# Altium project IMX8SoCIot.PrjPcb (part 5 of 9)

## Sheet IMX8_PHY.SchDoc
size 594 x 420 mm; SheetNumber: 9; SheetTotal: 20
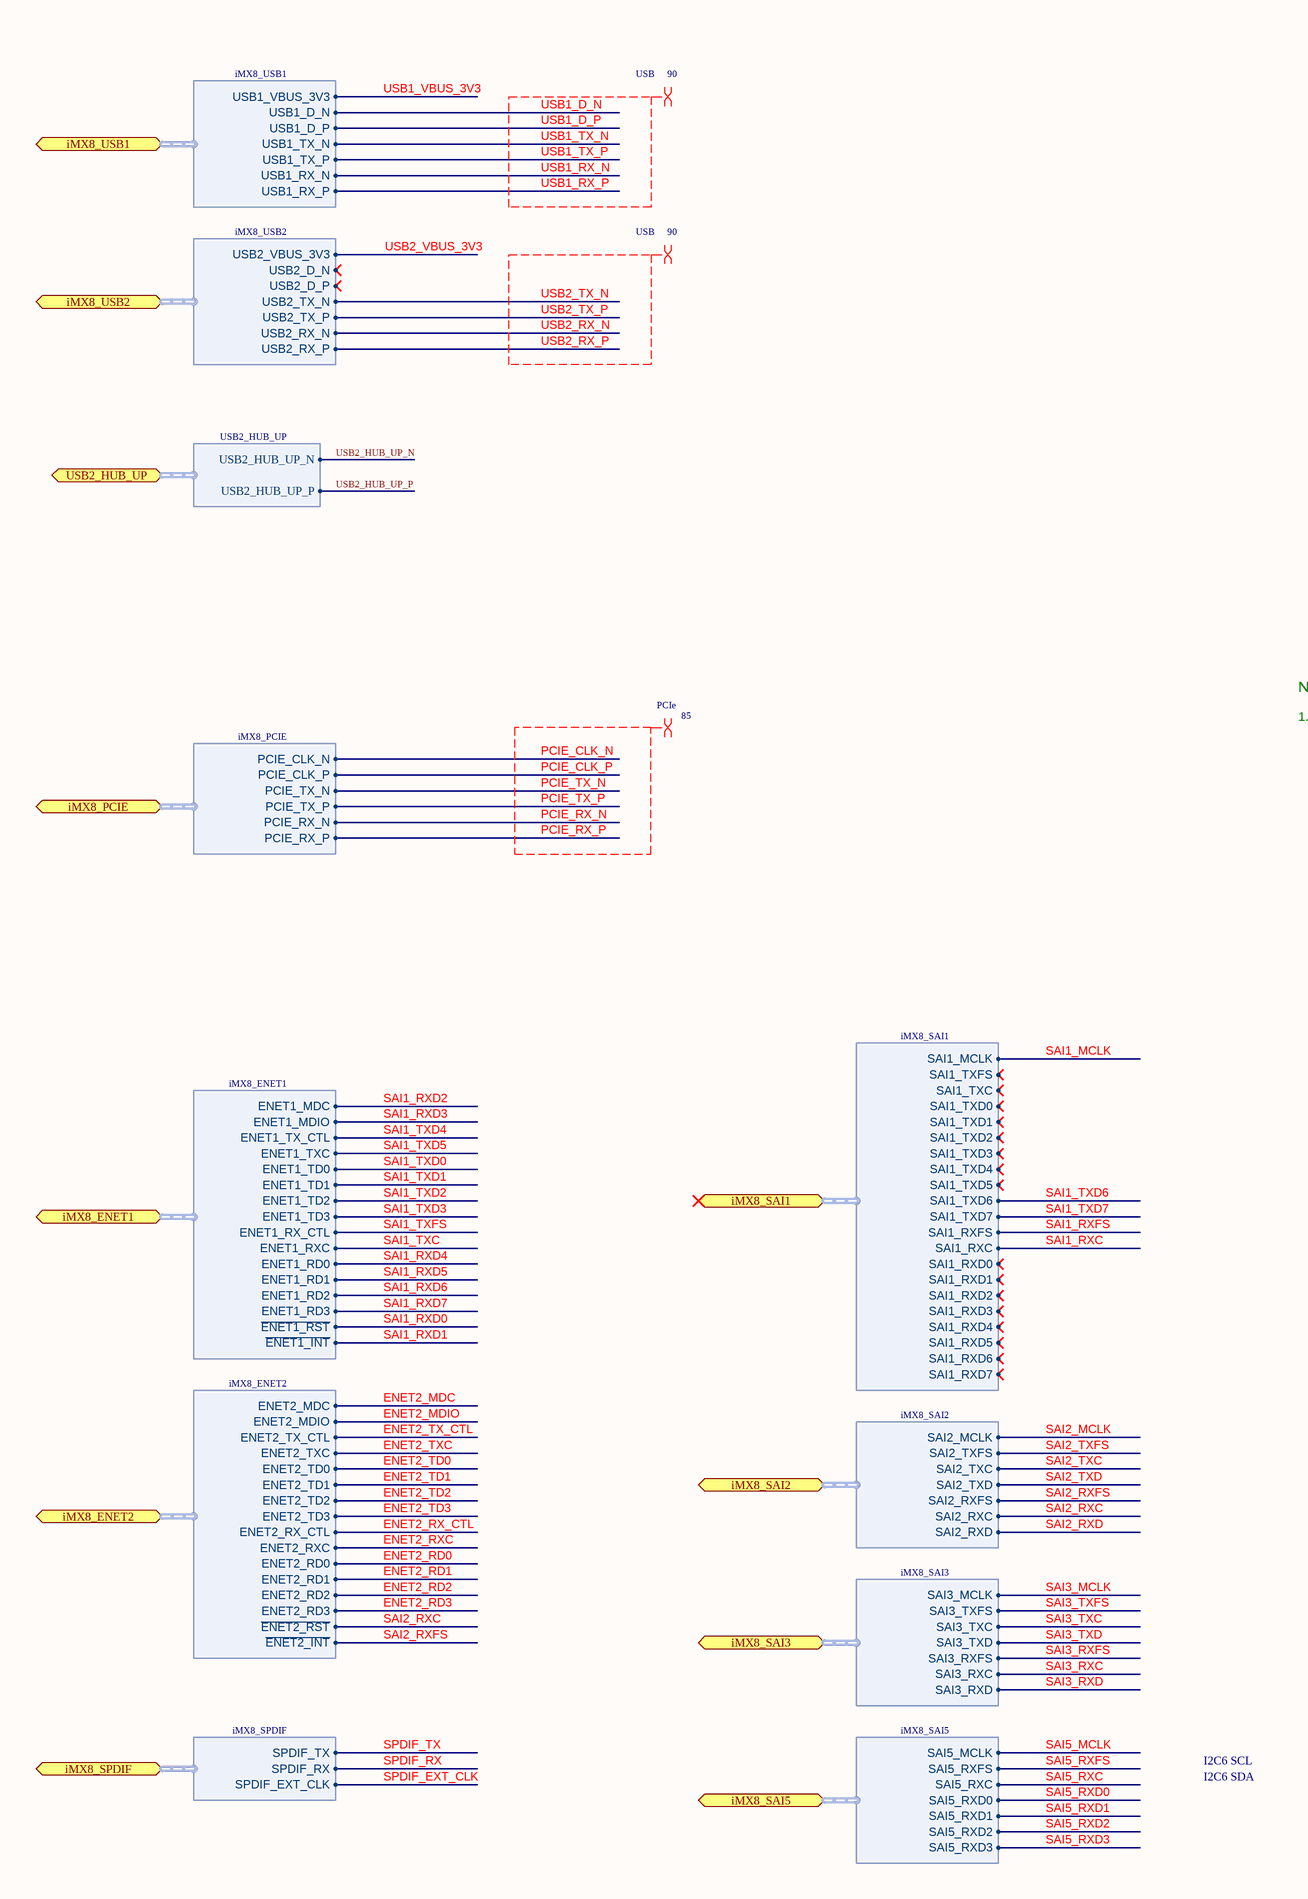
[diagram p18: IMX8_PHY.SchDoc, left]
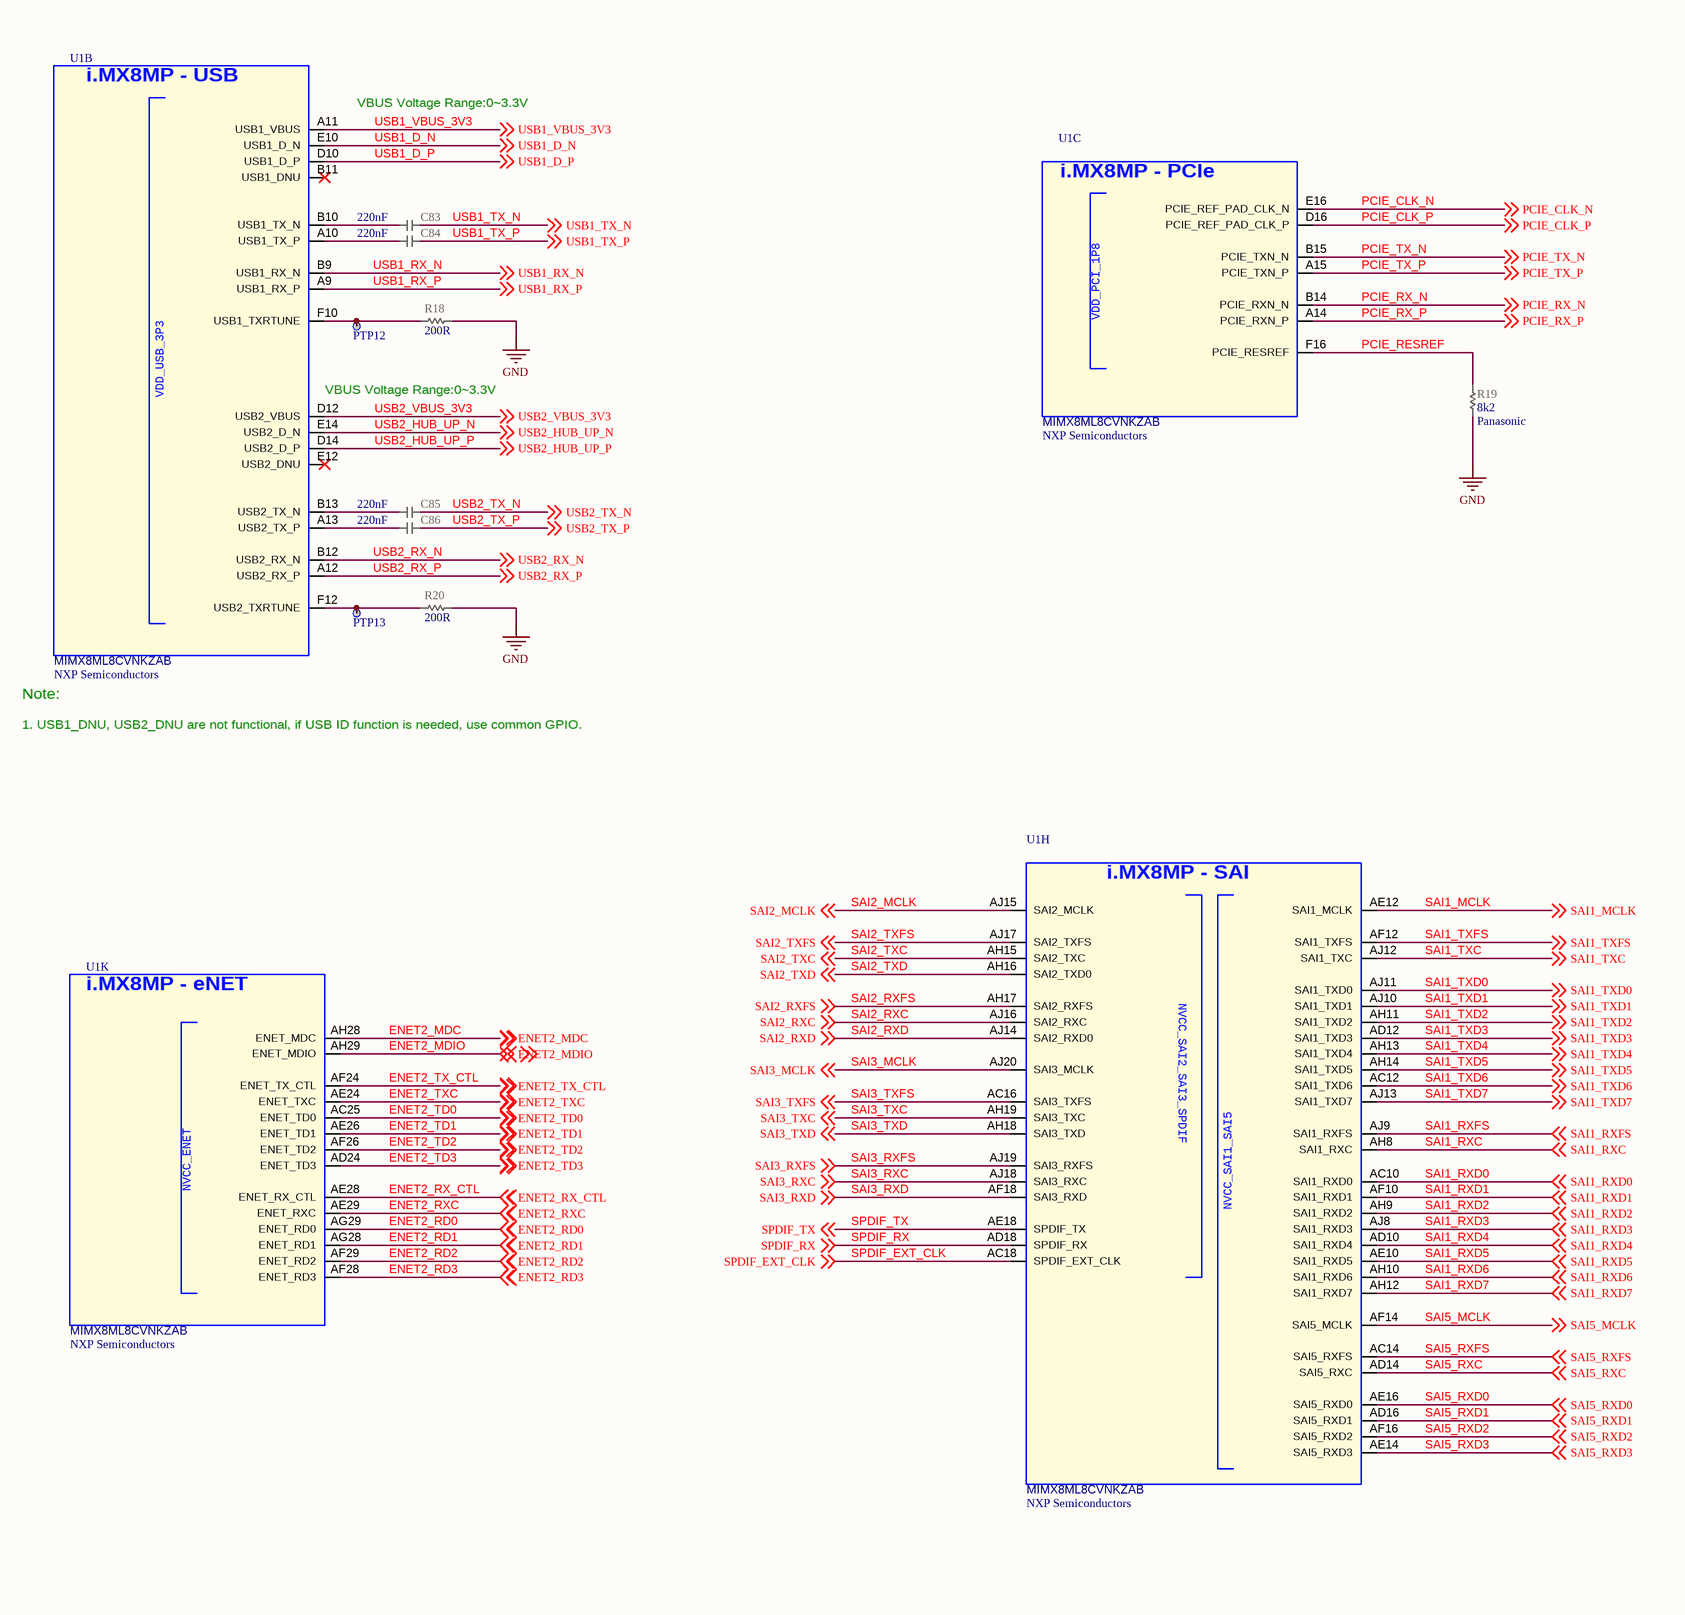
[diagram p19: IMX8_PHY.SchDoc, right]

### Parts
(Parts that share a designator on the sheet are numbered #1, #2 ... from top to bottom, then left to right.)
C83  value 220nF  [CAP_0201_UN1Q]  (hidden comment: CAP_0201_220n_10V_X6S)
C84  value 220nF  [CAP_0201_UN1Q]  (hidden comment: CAP_0201_220n_10V_X6S)
C85  value 220nF  [CAP_0201_UN1Q]  (hidden comment: CAP_0201_220n_10V_X6S)
C86  value 220nF  [CAP_0201_UN1Q]  (hidden comment: CAP_0201_220n_10V_X6S)
PTP12  PTP_0.4mm  [PTP_0.4mm]  (value not drawn)  (no BOM)
PTP13  PTP_0.4mm  [PTP_0.4mm]  (value not drawn)  (no BOM)
R18#2  value 200R  [RES_0201_UN1Q]  (hidden comment: RES_0201_200R)
R19#2  value 8k2  Manufacturer: Panasonic  [RES_0201_UN1Q]  (hidden comment: RES_0201_8k2)
R20  value 200R  [RES_0201_UN1Q]  (hidden comment: RES_0201_200R)
U1  Manufacturer: NXP Semiconductors  [BGA548C50P29X29_1500X1500X148]  (hidden comment: MIMX8ML8CVNKZAB)  (parts B,C,H,K of 15)

### Ports
iMX8_ENET1 (bidir, harness iMX8_ENET1), iMX8_ENET2 (bidir, harness iMX8_ENET2), iMX8_PCIE (bidir, harness iMX8_PCIE), iMX8_SAI1 (bidir, harness iMX8_SAI1), iMX8_SAI2 (bidir, harness iMX8_SAI2), iMX8_SAI3 (bidir, harness iMX8_SAI3), iMX8_SAI5 (bidir, harness iMX8_SAI5), iMX8_SPDIF (bidir, harness iMX8_SPDIF), iMX8_USB1 (bidir, harness iMX8_USB1), iMX8_USB2 (bidir, harness iMX8_USB2), USB2_HUB_UP (bidir, harness USB2_HUB_UP)

### Harnesses
iMX8_USB1: USB1_VBUS_3V3, USB1_D_N, USB1_D_P, USB1_TX_N, USB1_TX_P, USB1_RX_N, USB1_RX_P
iMX8_USB2: USB2_VBUS_3V3, USB2_D_N, USB2_D_P, USB2_TX_N, USB2_TX_P, USB2_RX_N, USB2_RX_P
USB2_HUB_UP: USB2_HUB_UP_P, USB2_HUB_UP_N
iMX8_ENET1: ENET1_MDC, ENET1_MDIO, ENET1_TX_CTL, ENET1_TXC, ENET1_TD0, ENET1_TD1, ENET1_TD2, ENET1_TD3, ENET1_RX_CTL, ENET1_RXC, ENET1_RD0, ENET1_RD1, ENET1_RD2, ENET1_RD3, ~{ENET1_RST}, ~{ENET1_INT}
iMX8_ENET2: ENET2_MDC, ENET2_MDIO, ENET2_TX_CTL, ENET2_TXC, ENET2_TD0, ENET2_TD1, ENET2_TD2, ENET2_TD3, ENET2_RX_CTL, ENET2_RXC, ENET2_RD0, ENET2_RD1, ENET2_RD2, ENET2_RD3, ~{ENET2_RST}, ~{ENET2_INT}
iMX8_PCIE: PCIE_CLK_N, PCIE_CLK_P, PCIE_TX_N, PCIE_TX_P, PCIE_RX_N, PCIE_RX_P
iMX8_SPDIF: SPDIF_TX, SPDIF_RX, SPDIF_EXT_CLK
iMX8_SAI2: SAI2_MCLK, SAI2_TXFS, SAI2_TXC, SAI2_TXD, SAI2_RXFS, SAI2_RXC, SAI2_RXD
iMX8_SAI3: SAI3_MCLK, SAI3_TXFS, SAI3_TXC, SAI3_TXD, SAI3_RXFS, SAI3_RXC, SAI3_RXD
iMX8_SAI5: SAI5_MCLK, SAI5_RXFS, SAI5_RXC, SAI5_RXD0, SAI5_RXD1, SAI5_RXD2, SAI5_RXD3
iMX8_SAI1: SAI1_MCLK, SAI1_TXFS, SAI1_TXC, SAI1_TXD0, SAI1_TXD1, SAI1_TXD2, SAI1_TXD3, SAI1_TXD4, SAI1_TXD5, SAI1_TXD6, SAI1_TXD7, SAI1_RXFS, SAI1_RXC, SAI1_RXD0, SAI1_RXD1, SAI1_RXD2, SAI1_RXD3, SAI1_RXD4, SAI1_RXD5, SAI1_RXD6, SAI1_RXD7

### Nets
GND: R18#2.1 R19#2.1 R20.1
ENET2_MDC: U1.AH28(ENET_MDC) ; off-sheet ENET2_MDC, port iMX8_ENET2.ENET2_MDC
ENET2_MDIO: U1.AH29(ENET_MDIO) ; off-sheet ENET2_MDIO, port iMX8_ENET2.ENET2_MDIO
ENET2_RD0: U1.AG29(ENET_RD0) ; off-sheet ENET2_RD0, port iMX8_ENET2.ENET2_RD0
ENET2_RD1: U1.AG28(ENET_RD1) ; off-sheet ENET2_RD1, port iMX8_ENET2.ENET2_RD1
ENET2_RD2: U1.AF29(ENET_RD2) ; off-sheet ENET2_RD2, port iMX8_ENET2.ENET2_RD2
ENET2_RD3: U1.AF28(ENET_RD3) ; off-sheet ENET2_RD3, port iMX8_ENET2.ENET2_RD3
ENET2_RX_CTL: U1.AE28(ENET_RX_CTL) ; off-sheet ENET2_RX_CTL, port iMX8_ENET2.ENET2_RX_CTL
ENET2_RXC: U1.AE29(ENET_RXC) ; off-sheet ENET2_RXC, port iMX8_ENET2.ENET2_RXC
ENET2_TD0: U1.AC25(ENET_TD0) ; off-sheet ENET2_TD0, port iMX8_ENET2.ENET2_TD0
ENET2_TD1: U1.AE26(ENET_TD1) ; off-sheet ENET2_TD1, port iMX8_ENET2.ENET2_TD1
ENET2_TD2: U1.AF26(ENET_TD2) ; off-sheet ENET2_TD2, port iMX8_ENET2.ENET2_TD2
ENET2_TD3: U1.AD24(ENET_TD3) ; off-sheet ENET2_TD3, port iMX8_ENET2.ENET2_TD3
ENET2_TX_CTL: U1.AF24(ENET_TX_CTL) ; off-sheet ENET2_TX_CTL, port iMX8_ENET2.ENET2_TX_CTL
ENET2_TXC: U1.AE24(ENET_TXC) ; off-sheet ENET2_TXC, port iMX8_ENET2.ENET2_TXC
PCIE_CLK_N: U1.E16(PCIE_REF_PAD_CLK_N) ; off-sheet PCIE_CLK_N, port iMX8_PCIE.PCIE_CLK_N  [project net mPCIe_CLK_N]
PCIE_CLK_P: U1.D16(PCIE_REF_PAD_CLK_P) ; off-sheet PCIE_CLK_P, port iMX8_PCIE.PCIE_CLK_P  [project net mPCIe_CLK_P]
PCIE_RESREF: R19#2.2 U1.F16(PCIE_RESREF)
PCIE_RX_N: U1.B14(PCIE_RXN_N) ; off-sheet PCIE_RX_N, port iMX8_PCIE.PCIE_RX_N  [project net mPCIe_RX_N]
PCIE_RX_P: U1.A14(PCIE_RXN_P) ; off-sheet PCIE_RX_P, port iMX8_PCIE.PCIE_RX_P  [project net mPCIe_RX_P]
PCIE_TX_N: U1.B15(PCIE_TXN_N) ; off-sheet PCIE_TX_N, port iMX8_PCIE.PCIE_TX_N  [project net mPCIe_TX_N]
PCIE_TX_P: U1.A15(PCIE_TXN_P) ; off-sheet PCIE_TX_P, port iMX8_PCIE.PCIE_TX_P  [project net mPCIe_TX_P]
SAI1_MCLK: U1.AE12(SAI1_MCLK) ; off-sheet SAI1_MCLK, port iMX8_SAI1.SAI1_MCLK
SAI1_RXC: U1.AH8(SAI1_RXC) ; off-sheet SAI1_RXC, port iMX8_SAI1.SAI1_RXC
SAI1_RXD0: U1.AC10(SAI1_RXD0) ; off-sheet SAI1_RXD0, port iMX8_ENET1.~{ENET1_RST}  [project net ~{ENET1_RST}]
SAI1_RXD1: U1.AF10(SAI1_RXD1) ; off-sheet SAI1_RXD1, port iMX8_ENET1.~{ENET1_INT}  [project net ~{ENET1_INT}]
SAI1_RXD2: U1.AH9(SAI1_RXD2) ; off-sheet SAI1_RXD2, port iMX8_ENET1.ENET1_MDC  [project net ENET1_MDC]
SAI1_RXD3: U1.AJ8(SAI1_RXD3) ; off-sheet SAI1_RXD3, port iMX8_ENET1.ENET1_MDIO  [project net ENET1_MDIO]
SAI1_RXD4: U1.AD10(SAI1_RXD4) ; off-sheet SAI1_RXD4, port iMX8_ENET1.ENET1_RD0  [project net ENET1_RD0]
SAI1_RXD5: U1.AE10(SAI1_RXD5) ; off-sheet SAI1_RXD5, port iMX8_ENET1.ENET1_RD1  [project net ENET1_RD1]
SAI1_RXD6: U1.AH10(SAI1_RXD6) ; off-sheet SAI1_RXD6, port iMX8_ENET1.ENET1_RD2  [project net ENET1_RD2]
SAI1_RXD7: U1.AH12(SAI1_RXD7) ; off-sheet SAI1_RXD7, port iMX8_ENET1.ENET1_RD3  [project net ENET1_RD3]
SAI1_RXFS: U1.AJ9(SAI1_RXFS) ; off-sheet SAI1_RXFS, port iMX8_SAI1.SAI1_RXFS
SAI1_TXC: U1.AJ12(SAI1_TXC) ; off-sheet SAI1_TXC, port iMX8_ENET1.ENET1_RXC  [project net ENET1_RXC]
SAI1_TXD0: U1.AJ11(SAI1_TXD0) ; off-sheet SAI1_TXD0, port iMX8_ENET1.ENET1_TD0  [project net ENET1_TD0]
SAI1_TXD1: U1.AJ10(SAI1_TXD1) ; off-sheet SAI1_TXD1, port iMX8_ENET1.ENET1_TD1  [project net ENET1_TD1]
SAI1_TXD2: U1.AH11(SAI1_TXD2) ; off-sheet SAI1_TXD2, port iMX8_ENET1.ENET1_TD2  [project net ENET1_TD2]
SAI1_TXD3: U1.AD12(SAI1_TXD3) ; off-sheet SAI1_TXD3, port iMX8_ENET1.ENET1_TD3  [project net ENET1_TD3]
SAI1_TXD4: U1.AH13(SAI1_TXD4) ; off-sheet SAI1_TXD4, port iMX8_ENET1.ENET1_TX_CTL  [project net ENET1_TX_CTL]
SAI1_TXD5: U1.AH14(SAI1_TXD5) ; off-sheet SAI1_TXD5, port iMX8_ENET1.ENET1_TXC  [project net ENET1_TXC]
SAI1_TXD6: U1.AC12(SAI1_TXD6) ; off-sheet SAI1_TXD6, port iMX8_SAI1.SAI1_TXD6
SAI1_TXD7: U1.AJ13(SAI1_TXD7) ; off-sheet SAI1_TXD7, port iMX8_SAI1.SAI1_TXD7
SAI1_TXFS: U1.AF12(SAI1_TXFS) ; off-sheet SAI1_TXFS, port iMX8_ENET1.ENET1_RX_CTL  [project net ENET1_RX_CTL]
SAI2_MCLK: U1.AJ15(SAI2_MCLK) ; off-sheet SAI2_MCLK, port iMX8_SAI2.SAI2_MCLK
SAI2_RXC: U1.AJ16(SAI2_RXC) ; off-sheet SAI2_RXC, port iMX8_ENET2.~{ENET2_RST}, port iMX8_SAI2.SAI2_RXC  [project net ~{ENET2_RST}]
SAI2_RXD: U1.AJ14(SAI2_RXD0) ; off-sheet SAI2_RXD, port iMX8_SAI2.SAI2_RXD
SAI2_RXFS: U1.AH17(SAI2_RXFS) ; off-sheet SAI2_RXFS, port iMX8_ENET2.~{ENET2_INT}, port iMX8_SAI2.SAI2_RXFS  [project net ~{ENET2_INT}]
SAI2_TXC: U1.AH15(SAI2_TXC) ; off-sheet SAI2_TXC, port iMX8_SAI2.SAI2_TXC
SAI2_TXD: U1.AH16(SAI2_TXD0) ; off-sheet SAI2_TXD, port iMX8_SAI2.SAI2_TXD
SAI2_TXFS: U1.AJ17(SAI2_TXFS) ; off-sheet SAI2_TXFS, port iMX8_SAI2.SAI2_TXFS
SAI3_MCLK: U1.AJ20(SAI3_MCLK) ; off-sheet SAI3_MCLK, port iMX8_SAI3.SAI3_MCLK
SAI3_RXC: U1.AJ18(SAI3_RXC) ; off-sheet SAI3_RXC, port iMX8_SAI3.SAI3_RXC
SAI3_RXD: U1.AF18(SAI3_RXD) ; off-sheet SAI3_RXD, port iMX8_SAI3.SAI3_RXD
SAI3_RXFS: U1.AJ19(SAI3_RXFS) ; off-sheet SAI3_RXFS, port iMX8_SAI3.SAI3_RXFS
SAI3_TXC: U1.AH19(SAI3_TXC) ; off-sheet SAI3_TXC, port iMX8_SAI3.SAI3_TXC
SAI3_TXD: U1.AH18(SAI3_TXD) ; off-sheet SAI3_TXD, port iMX8_SAI3.SAI3_TXD
SAI3_TXFS: U1.AC16(SAI3_TXFS) ; off-sheet SAI3_TXFS, port iMX8_SAI3.SAI3_TXFS
SAI5_MCLK: U1.AF14(SAI5_MCLK) ; off-sheet SAI5_MCLK, port iMX8_SAI5.SAI5_MCLK
SAI5_RXC: U1.AD14(SAI5_RXC) ; off-sheet SAI5_RXC, port iMX8_SAI5.SAI5_RXC  [project net I2C6_SDA]
SAI5_RXD0: U1.AE16(SAI5_RXD0) ; off-sheet SAI5_RXD0, port iMX8_SAI5.SAI5_RXD0
SAI5_RXD1: U1.AD16(SAI5_RXD1) ; off-sheet SAI5_RXD1, port iMX8_SAI5.SAI5_RXD1
SAI5_RXD2: U1.AF16(SAI5_RXD2) ; off-sheet SAI5_RXD2, port iMX8_SAI5.SAI5_RXD2
SAI5_RXD3: U1.AE14(SAI5_RXD3) ; off-sheet SAI5_RXD3, port iMX8_SAI5.SAI5_RXD3
SAI5_RXFS: U1.AC14(SAI5_RXFS) ; off-sheet SAI5_RXFS, port iMX8_SAI5.SAI5_RXFS  [project net I2C6_SCL]
SPDIF_EXT_CLK: U1.AC18(SPDIF_EXT_CLK) ; off-sheet SPDIF_EXT_CLK, port iMX8_SPDIF.SPDIF_EXT_CLK  [project net I2C5_SDA]
SPDIF_RX: U1.AD18(SPDIF_RX) ; off-sheet SPDIF_RX, port iMX8_SPDIF.SPDIF_RX
SPDIF_TX: U1.AE18(SPDIF_TX) ; off-sheet SPDIF_TX, port iMX8_SPDIF.SPDIF_TX  [project net I2C5_SCL]
USB1_D_N: U1.E10(USB1_D_N) ; off-sheet USB1_D_N, port iMX8_USB1.USB1_D_N
USB1_D_P: U1.D10(USB1_D_P) ; off-sheet USB1_D_P, port iMX8_USB1.USB1_D_P
USB1_RX_N: U1.B9(USB1_RX_N) ; off-sheet USB1_RX_N, port iMX8_USB1.USB1_RX_N
USB1_RX_P: U1.A9(USB1_RX_P) ; off-sheet USB1_RX_P, port iMX8_USB1.USB1_RX_P
USB1_TX_N: C83.1 ; off-sheet USB1_TX_N, port iMX8_USB1.USB1_TX_N
USB1_TX_P: C84.1 ; off-sheet USB1_TX_P, port iMX8_USB1.USB1_TX_P
USB1_VBUS_3V3: U1.A11(USB1_VBUS) ; off-sheet USB1_VBUS_3V3, port iMX8_USB1.USB1_VBUS_3V3
USB2_HUB_UP_N: U1.E14(USB2_D_N) ; off-sheet USB2_HUB_UP_N, port USB2_HUB_UP.USB2_HUB_UP_N
USB2_HUB_UP_P: U1.D14(USB2_D_P) ; off-sheet USB2_HUB_UP_P, port USB2_HUB_UP.USB2_HUB_UP_P
USB2_RX_N: U1.B12(USB2_RX_N) ; off-sheet USB2_RX_N, port iMX8_USB2.USB2_RX_N
USB2_RX_P: U1.A12(USB2_RX_P) ; off-sheet USB2_RX_P, port iMX8_USB2.USB2_RX_P
USB2_TX_N: C85.1 ; off-sheet USB2_TX_N, port iMX8_USB2.USB2_TX_N
USB2_TX_P: C86.1 ; off-sheet USB2_TX_P, port iMX8_USB2.USB2_TX_P
USB2_VBUS_3V3: U1.D12(USB2_VBUS) ; off-sheet USB2_VBUS_3V3, port iMX8_USB2.USB2_VBUS_3V3
NetC83_2: C83.2 U1.B10(USB1_TX_N)
NetC84_2: C84.2 U1.A10(USB1_TX_P)
NetC85_2: C85.2 U1.B13(USB2_TX_N)
NetC86_2: C86.2 U1.A13(USB2_TX_P)
NetPTP12_1: PTP12.1(TP) R18#2.2 U1.F10(USB1_TXRTUNE)
NetPTP13_1: PTP13.1(TP) R20.2 U1.F12(USB2_TXRTUNE)

Not connected (* = marked no-connect by the designer): U1 B11(USB1_DNU)* E12(USB2_DNU)*

### Layout directives
differential pair; differential pair class 90; net class USB; rule Matched Net Lengths [Tolerance = 0.3mm]: USB1_D_N, USB1_D_P, USB1_RX_N, USB1_RX_P, USB1_TX_N, USB1_TX_P, USB2_RX_N, USB2_RX_P, USB2_TX_N, USB2_TX_P
differential pair; net class PCIe; rule Matched Net Lengths [Tolerance = 0.1mm]; differential pair class 85: PCIE_CLK_N, PCIE_CLK_P, PCIE_RX_N, PCIE_RX_P, PCIE_TX_N, PCIE_TX_P

### Notes on the sheet
- (near U1) VBUS Voltage Range:0~3.3V
- 1. USB1_DNU, USB2_DNU are not functional, if USB ID function is needed, use common GPIO.
- Note:
- I2C6 SDA
- I2C6 SCL
- DWG NO:
- REV:
- THIS DOCUMENT AND THE DATA DISCLOSED HEREIN OR
- HEREWITH IS THE PROPERTY OF ALTIUM LIMITED AND MAY
- BE FREELY DISTRIBUTED IN WHOLE. NO RIGHTS ARE
- RESERVED OR EXPRESS OR IMPLIED WARANTEE GIVEN.
- REVISION
- DESCRIPTION
- DATE
- APPROVED
- ENG:
- APPROVALS
- PROJECT
- DSN:
- CHK:
- REFERENCE DOCUMENTS
- PROJECT REVISION:
- TITLE
- DOCUMENT REVISION:
- DESIGN ITEM:
- BOM:
- FAB DWG:
- PCB DWG:
- ASSY DWG:
- SCALE:
- A2
- SIZE
- CAGE CODE
- FILE NAME
- DWG NO.
- SHEET
- OF
- REV
- (in symbol CMP-001-000983-8, part B) i.MX8MP - USB
- (in symbol CMP-001-000983-8, part C) i.MX8MP - PCIe
- (in symbol CMP-001-000983-8, part H) i.MX8MP - SAI
- (in symbol CMP-001-000983-8, part K) i.MX8MP - eNET

### Library data of the parts
C83-C86 = CMP-001-000889-11: CAP; Part Number: GRM033C81A224KE01D; Manufacturer: Murata; Temperature characteristics: X6S; Voltage: 10V; Tolerance: +/-20%; Sort order: 302; HasBeenBuilt: TBD; Alternative component: Allowed; System: RLC; Package: 0201; Dimensions WxLxH: 0.35; ComponentLink1Description: 1_Datasheet; ComponentLink2Description: 2_Product page; ComponentLink3Description: 3_X-information; ComponentLink4Description: 4_X-information; Creation date: 26042024; ClassName: SMALL
PTP12 PTP13 = CMP-001-001296-3: Production Testpoint 0.4mm. Flying probe. Use 1mm pitch.; ComponentLink4Description: 4_X-information; ComponentLink1Description: 1_Datasheet; Part Number: PTP 0.4mm; Sort order: -; ClassName: SMALL; System: Test Point; HasBeenBuilt: -; Design Item ID: PTP_0.4mm; ComponentLink3Description: 3_X-information; Creation date: 20240909; ComponentLink2Description: 2_Product page
R18#2 R20 = CMP-001-000549-13: RES; Part Number: CRCW0201200RFNED; Manufacturer: Vishay Dale; Tolerance: 1%; Power Rating: 1/20W; Sort order: 322; HasBeenBuilt: TBD; Alternative component: Allowed; System: RLC; Package: 0201; ClassName: SMALL; ComponentLink1Description: 1_Datasheet; ComponentLink2Description: 2_Product page; ComponentLink3Description: 3_X-information; ComponentLink4Description: 4_X-information; Creation date: 20190101; Source: RLC_UN1Q.SchLib
R19#2 = CMP-001-001255-9: RES; Part Number: ERJ1GNF8201C; Manufacturer: Panasonic Electronic Components; Tolerance: 1%; Power Rating: 1/20W; Sort order: 322; Alternative component: Allowed; System: RLC; Package: 0201; ClassName: SMALL; ComponentLink1Description: 1_Datasheet; ComponentLink2Description: 2_Product page; ComponentLink3Description: 3_X-information; ComponentLink4Description: 4_X-information; Creation date: 20240404; Manufacturer Part Number: ERJ1GNF8201C; Component Type: Resistor
U1 = CMP-001-000983-8: CPU QUAD CORTEX A53+M4 1.6GHZ BGA548 Industrial; Sort order: 501; System: IC; ComponentLink1Description: 1_Datasheet; ComponentLink1URL: https://www.nxp.com/part/MIMX8ML8CVNKZAB#/; ComponentLink2Description: 2_Product page; ComponentLink3Description: 3_X-information; ComponentLink4Description: 4_X-information; Creation date: 20240524; Dimensions WxLxH: 15 x 15 x 1.33mm; Manufacturer: NXP SEMICONDUCTORS; Operating temperature range: -40... +105 °C; Package: FCBGA548; Part Number: MIMX8ML8CVNKZAB; ClassName: BIG; Source: UUDET_KOMPONENTIT.SchLib; Design Item ID: MIMX8ML8CVNKZAB; Manufacturer Part Number: MIMX8ML8CVNKZAB; Component Type: Processor

## Sheet IMX8_PMIC.SchDoc
size 594 x 420 mm; SheetNumber: 13; SheetTotal: 20
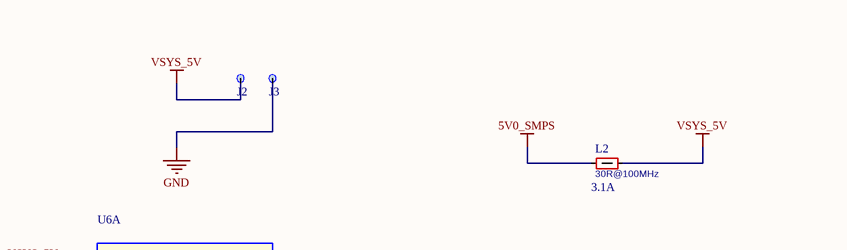
[diagram p20: IMX8_PMIC.SchDoc, top left]
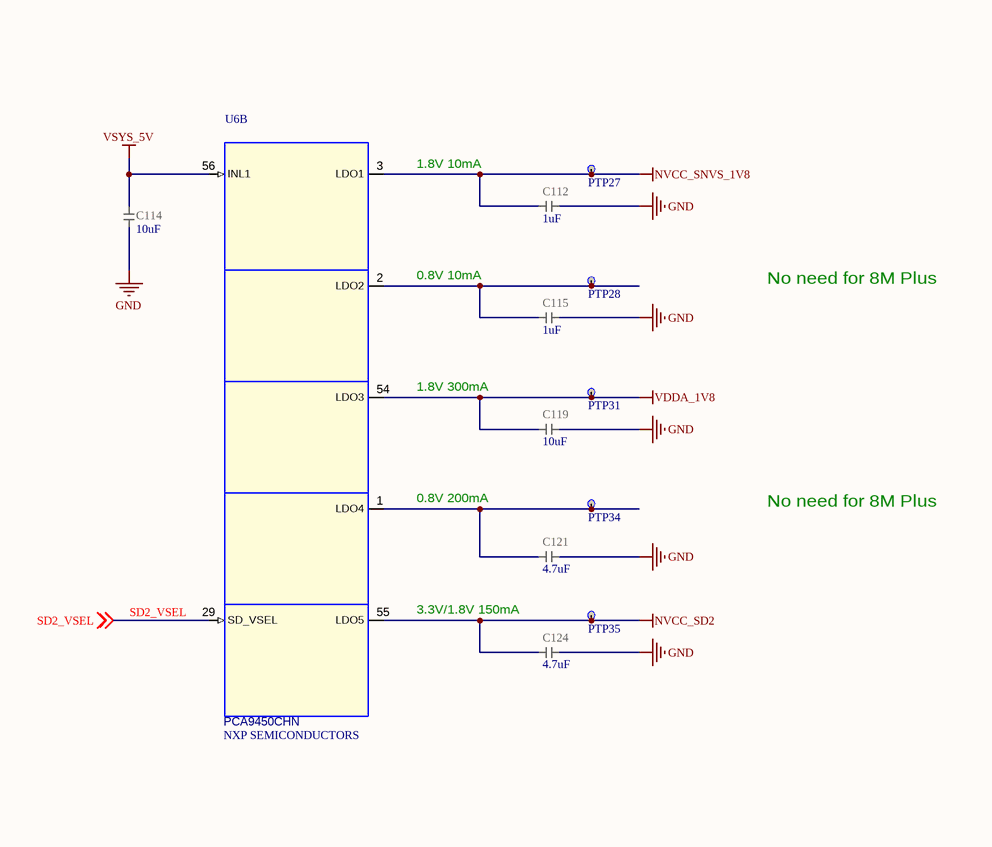
[diagram p21: IMX8_PMIC.SchDoc, top right]
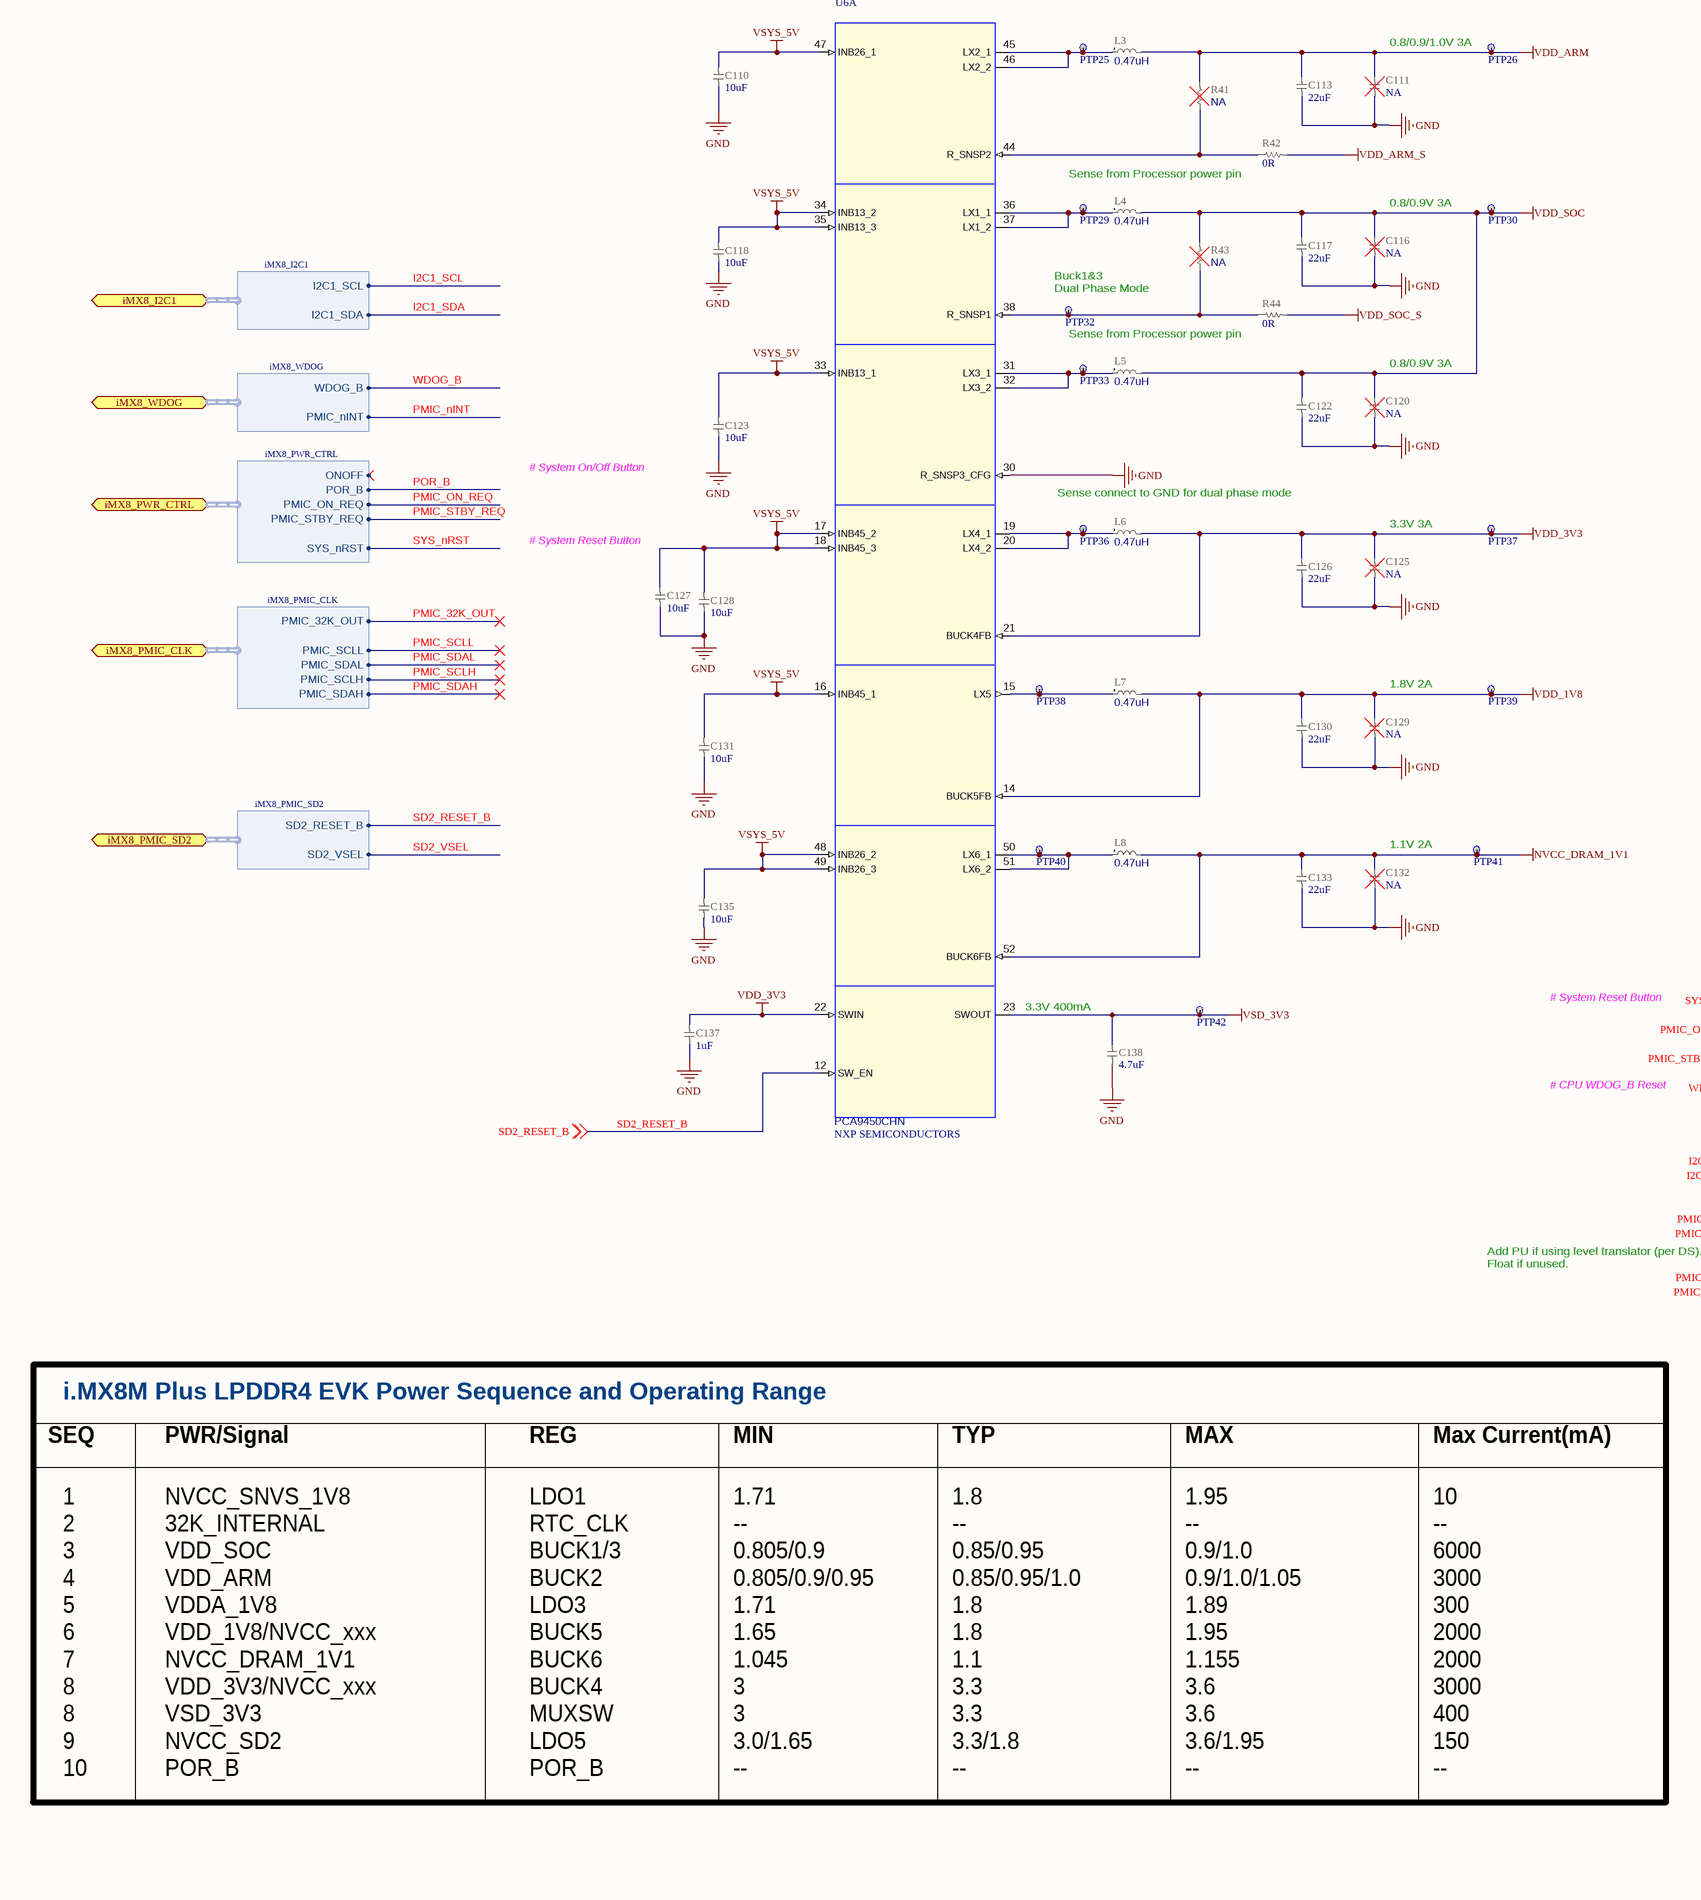
[diagram p22: IMX8_PMIC.SchDoc, bottom left]
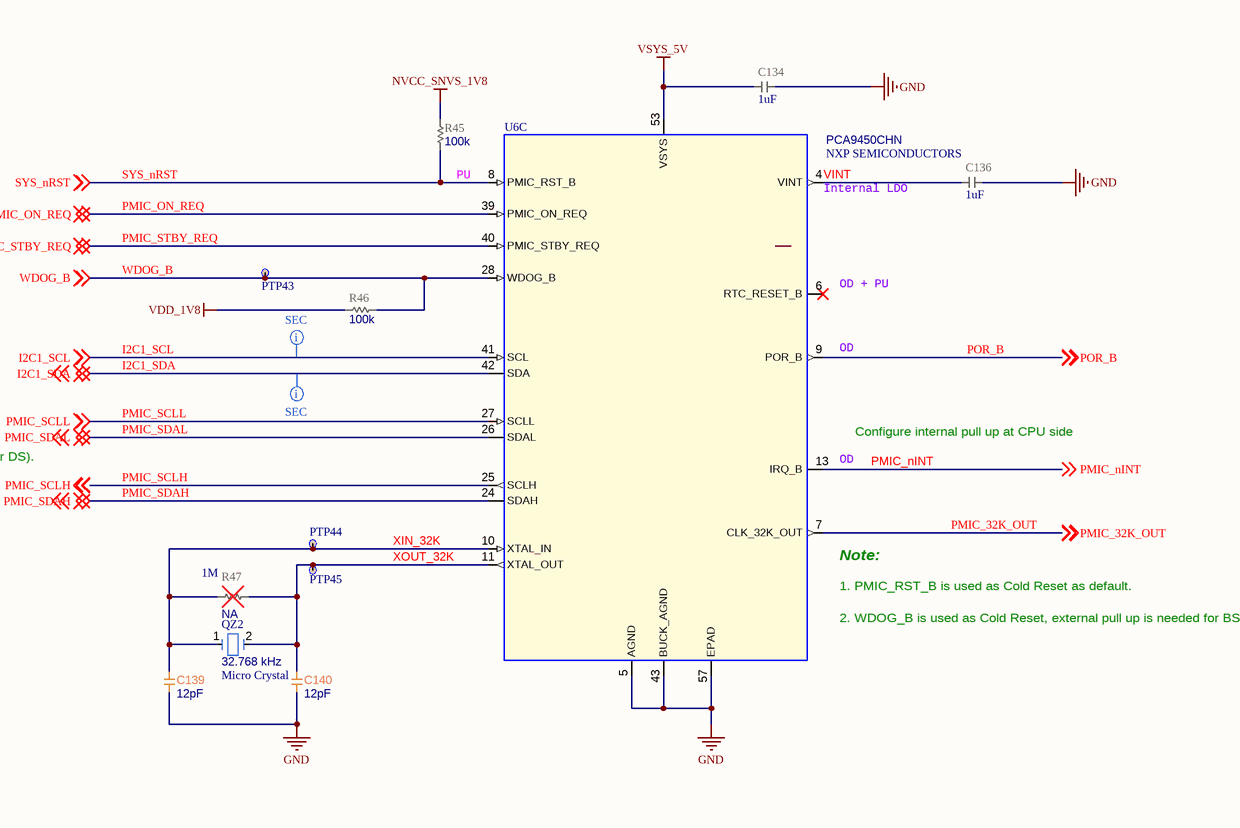
[diagram p23: IMX8_PMIC.SchDoc, bottom right]

### Parts
(Parts that share a designator on the sheet are numbered #1, #2 ... from top to bottom, then left to right.)
C110#2  value 10uF  [CAP_0603_UN1Q]  (hidden comment: CAP_0603_10u_10V_X7R)
C111#2  value NA  [CAP_0603_UN1Q]  (hidden comment: CAP_0603_NA)
C112#2  value 1uF  [CAP_0201_UN1Q]  (hidden comment: CAP_0201_1uF_X6S)
C113#2  value 22uF  [CAP_0603_UN1Q]  (hidden comment: CAP_0603_22u_6.3V_X6S)
C114#2  value 10uF  [CAP_0603_UN1Q]  (hidden comment: CAP_0603_10u_10V_X7R)
C115#2  value 1uF  [CAP_0201_UN1Q]  (hidden comment: CAP_0201_1uF_X6S)
C116#2  value NA  [CAP_0603_UN1Q]  (hidden comment: CAP_0603_NA)
C117#2  value 22uF  [CAP_0603_UN1Q]  (hidden comment: CAP_0603_22u_6.3V_X6S)
C118#2  value 10uF  [CAP_0603_UN1Q]  (hidden comment: CAP_0603_10u_10V_X7R)
C119#2  value 10uF  [CAP_0402_H09W07_UN1Q]  (hidden comment: CAP_0402_10u_X6S)
C120  value NA  [CAP_0603_UN1Q]  (hidden comment: CAP_0603_NA)
C121  value 4.7uF  [CAP_0402_H09W07_UN1Q]  (hidden comment: CAP_0402_4u7_10V_X6S)
C122  value 22uF  [CAP_0603_UN1Q]  (hidden comment: CAP_0603_22u_6.3V_X6S)
C123  value 10uF  [CAP_0603_UN1Q]  (hidden comment: CAP_0603_10u_10V_X7R)
C124  value 4.7uF  [CAP_0402_H09W07_UN1Q]  (hidden comment: CAP_0402_4u7_10V_X6S)
C125  value NA  [CAP_0603_UN1Q]  (hidden comment: CAP_0603_NA)
C126  value 22uF  [CAP_0603_UN1Q]  (hidden comment: CAP_0603_22u_6.3V_X6S)
C127  value 10uF  [CAP_0603_UN1Q]  (hidden comment: CAP_0603_10u_10V_X7R)
C128  value 10uF  [CAP_0603_UN1Q]  (hidden comment: CAP_0603_10u_10V_X7R)
C129  value NA  [CAP_0603_UN1Q]  (hidden comment: CAP_0603_NA)
C130  value 22uF  [CAP_0603_UN1Q]  (hidden comment: CAP_0603_22u_6.3V_X6S)
C131  value 10uF  [CAP_0603_UN1Q]  (hidden comment: CAP_0603_10u_10V_X7R)
C132#2  value NA  [CAP_0603_UN1Q]  (hidden comment: CAP_0603_NA)
C133#2  value 22uF  [CAP_0603_UN1Q]  (hidden comment: CAP_0603_22u_6.3V_X6S)
C134#2  value 1uF  [CAP_0402_UN1Q]  (hidden comment: CAP_0402_1uF_10V_X7R)
C135#2  value 10uF  [CAP_0603_UN1Q]  (hidden comment: CAP_0603_10u_10V_X7R)
C136#2  value 1uF  [CAP_0402_UN1Q]  (hidden comment: CAP_0402_1uF_10V_X7R)
C137  value 1uF  [CAP_0402_UN1Q]  (hidden comment: CAP_0402_1uF_10V_X7R)
C138  value 4.7uF  [CAP_0402_H09W07_UN1Q]  (hidden comment: CAP_0402_4u7_10V_X6S)
C139  value 12pF  [CAP_0201_UN1Q]  (hidden comment: CAP_0201_12pF_RF_MATCHING)
C140  value 12pF  [CAP_0201_UN1Q]  (hidden comment: CAP_0201_12pF_RF_MATCHING)
J2  PAD 1 x 2 mm  [TP_1x2mm_UN1Q]  (value not drawn)  (no BOM)
J3#2  PAD 1 x 2 mm  [TP_1x2mm_UN1Q]  (value not drawn)  (no BOM)
L2  value 30R@100MHz  Current: 3.1A  [FERR_BLM15KD]  (hidden comment: FERRITE_0402_BLM15KD)
L3  value 0.47uH  [IND_VLS2520]  (hidden comment: IND_VLS2520_0u47)
L4  value 0.47uH  [IND_VLS2520]  (hidden comment: IND_VLS2520_0u47)
L5  value 0.47uH  [IND_VLS2520]  (hidden comment: IND_VLS2520_0u47)
L6  value 0.47uH  [IND_VLS2520]  (hidden comment: IND_VLS2520_0u47)
L7  value 0.47uH  [IND_VLS2520]  (hidden comment: IND_VLS2520_0u47)
L8  value 0.47uH  [IND_VLS2520]  (hidden comment: IND_VLS2520_0u47)
PTP25#2  PTP_0.4mm  [PTP_0.4mm]  (value not drawn)  (no BOM)
PTP26#2  PTP_0.4mm  [PTP_0.4mm]  (value not drawn)  (no BOM)
PTP27#2  PTP_0.4mm  [PTP_0.4mm]  (value not drawn)  (no BOM)
PTP28#2  PTP_0.4mm  [PTP_0.4mm]  (value not drawn)  (no BOM)
PTP29#2  PTP_0.4mm  [PTP_0.4mm]  (value not drawn)  (no BOM)
PTP30  PTP_0.4mm  [PTP_0.4mm]  (value not drawn)  (no BOM)
PTP31  PTP_0.4mm  [PTP_0.4mm]  (value not drawn)  (no BOM)
PTP32  PTP_0.4mm  [PTP_0.4mm]  (value not drawn)  (no BOM)
PTP33  PTP_0.4mm  [PTP_0.4mm]  (value not drawn)  (no BOM)
PTP34  PTP_0.4mm  [PTP_0.4mm]  (value not drawn)  (no BOM)
PTP35  PTP_0.4mm  [PTP_0.4mm]  (value not drawn)  (no BOM)
PTP36  PTP_0.4mm  [PTP_0.4mm]  (value not drawn)  (no BOM)
PTP37  PTP_0.4mm  [PTP_0.4mm]  (value not drawn)  (no BOM)
PTP38#2  PTP_0.4mm  [PTP_0.4mm]  (value not drawn)  (no BOM)
PTP39#2  PTP_0.4mm  [PTP_0.4mm]  (value not drawn)  (no BOM)
PTP40#2  PTP_0.4mm  [PTP_0.4mm]  (value not drawn)  (no BOM)
PTP41  PTP_0.4mm  [PTP_0.4mm]  (value not drawn)  (no BOM)
PTP42  PTP_0.4mm  [PTP_0.4mm]  (value not drawn)  (no BOM)
PTP43  PTP_0.4mm  [PTP_0.4mm]  (value not drawn)  (no BOM)
PTP44  PTP_0.4mm  [PTP_0.4mm]  (value not drawn)  (no BOM)
PTP45  PTP_0.4mm  [PTP_0.4mm]  (value not drawn)  (no BOM)
QZ2  value 32.768 kHz  Manufacturer: Micro Crystal  [CM8V32768TA020125_MC]  (hidden comment: XTAL_CM8V-T1A-32_768KHZ-9PF-20PPM-TA-QC)
R41  value NA  [RES_0201_UN1Q]  (hidden comment: RES_0201_NA)
R42  value 0R  [RES_0201_UN1Q]  (hidden comment: RES_0201_0R)
R43  value NA  [RES_0201_UN1Q]  (hidden comment: RES_0201_NA)
R44  value 0R  [RES_0201_UN1Q]  (hidden comment: RES_0201_0R)
R45  value 100k  [RES_0201_UN1Q]  (hidden comment: RES_0201_100k)
R46  value 100k  [RES_0201_UN1Q]  (hidden comment: RES_0201_100k)
R47  value NA  [RES_0201_UN1Q]  (hidden comment: RES_0201_NA)
U6  Part Number: PCA9450CHN  Manufacturer: NXP SEMICONDUCTORS  [QFN57P40_700X700X100NXP]  (hidden comment: PCA9450_HVQFN56P_A)  (parts A,B,C of 3)

### Ports
iMX8_I2C1 (bidir, harness iMX8_I2C1), iMX8_PMIC_CLK (bidir, harness iMX8_PMIC_CLK), iMX8_PMIC_SD2 (bidir, harness iMX8_PMIC_SD2), iMX8_PWR_CTRL (bidir, harness iMX8_PWR_CTRL), iMX8_WDOG (bidir, harness iMX8_WDOG)

### Harnesses
iMX8_PMIC_CLK: PMIC_32K_OUT, PMIC_SCLL, PMIC_SDAL, PMIC_SCLH, PMIC_SDAH
iMX8_WDOG: WDOG_B, PMIC_nINT
iMX8_I2C1: I2C1_SCL, I2C1_SDA
iMX8_PWR_CTRL: ONOFF, POR_B, PMIC_ON_REQ, PMIC_STBY_REQ, SYS_nRST
iMX8_PMIC_SD2: SD2_RESET_B, SD2_VSEL

### Nets
5V0_SMPS: L2.1
GND: C110#2.1 C111#2.2 C112#2.2 C113#2.1 C114#2.1 C115#2.2 C116#2.2 C117#2.1 C118#2.1 C119#2.2 C120.2 C121.1 C122.1 C123.1 C124.1 C125.2 C126.1 C127.1 C128.1 C129.1 C130.2 C131.1 C132#2.2 C133#2.1 C134#2.1 C135#2.1 C136#2.1 C137.1 C138.2 C139.2 C140.2 J3#2.1(TP) U6.5(AGND) U6.30(R_SNSP3_CFG) U6.43(BUCK_AGND) U6.57(EPAD)
NVCC_DRAM_1V1: C132#2.1 C133#2.2 L8.2 PTP41.1(TP) U6.52(BUCK6FB)
NVCC_SD2: C124.2 PTP35.1(TP) U6.55(LDO5)
NVCC_SNVS_1V8: C112#2.1 PTP27#2.1(TP) R45.1 U6.3(LDO1)
VDD_1V8: C129.2 C130.1 L7.2 PTP39#2.1(TP) R46.1 U6.14(BUCK5FB)
VDD_3V3: C125.1 C126.2 C137.2 L6.2 PTP37.1(TP) U6.21(BUCK4FB) U6.22(SWIN)
VDD_ARM: C111#2.1 C113#2.2 L3.2 PTP26#2.1(TP) R41.2 R42.2  [also labelled VDD_ARM_S]
VDD_SOC: C116#2.1 C117#2.2 C120.1 C122.2 L4.2 L5.2 PTP30.1(TP) R43.2 R44.2  [also labelled VDD_SOC_S]
VDDA_1V8: C119#2.1 PTP31.1(TP) U6.54(LDO3)
VSD_3V3: C138.1 PTP42.1(TP) U6.23(SWOUT)
VSYS_5V: C110#2.2 C114#2.2 C118#2.2 C123.2 C127.2 C128.2 C131.2 C134#2.2 C135#2.2 J2.1(TP) L2.2 U6.16(INB45_1) U6.17(INB45_2) U6.18(INB45_3) U6.33(INB13_1) U6.34(INB13_2) U6.35(INB13_3) U6.47(INB26_1) U6.48(INB26_2) U6.49(INB26_3) U6.53(VSYS) U6.56(INL1)
I2C1_SCL: U6.41(SCL) ; off-sheet I2C1_SCL, port iMX8_I2C1.I2C1_SCL
I2C1_SDA: U6.42(SDA) ; off-sheet I2C1_SDA, port iMX8_I2C1.I2C1_SDA
PMIC_32K_OUT: U6.7(CLK_32K_OUT) ; off-sheet PMIC_32K_OUT, port iMX8_PMIC_CLK.PMIC_32K_OUT
PMIC_nINT: U6.13(IRQ_B) ; off-sheet PMIC_nINT, port iMX8_WDOG.PMIC_nINT
PMIC_ON_REQ: U6.39(PMIC_ON_REQ) ; off-sheet PMIC_ON_REQ, port iMX8_PWR_CTRL.PMIC_ON_REQ
PMIC_SCLH: U6.25(SCLH) ; off-sheet PMIC_SCLH, port iMX8_PMIC_CLK.PMIC_SCLH
PMIC_SCLL: U6.27(SCLL) ; off-sheet PMIC_SCLL, port iMX8_PMIC_CLK.PMIC_SCLL
PMIC_SDAH: U6.24(SDAH) ; off-sheet PMIC_SDAH, port iMX8_PMIC_CLK.PMIC_SDAH
PMIC_SDAL: U6.26(SDAL) ; off-sheet PMIC_SDAL, port iMX8_PMIC_CLK.PMIC_SDAL
PMIC_STBY_REQ: U6.40(PMIC_STBY_REQ) ; off-sheet PMIC_STBY_REQ, port iMX8_PWR_CTRL.PMIC_STBY_REQ
POR_B: U6.9(POR_B) ; off-sheet POR_B, port iMX8_PWR_CTRL.POR_B
SD2_RESET_B: U6.12(SW_EN) ; off-sheet SD2_RESET_B, port iMX8_PMIC_SD2.SD2_RESET_B
SD2_VSEL: U6.29(SD_VSEL) ; off-sheet SD2_VSEL, port iMX8_PMIC_SD2.SD2_VSEL
SYS_nRST: R45.2 U6.8(PMIC_RST_B) ; off-sheet SYS_nRST, port iMX8_PWR_CTRL.SYS_nRST
VINT: C136#2.2 U6.4(VINT)
WDOG_B: PTP43.1(TP) R46.2 U6.28(WDOG_B) ; off-sheet WDOG_B, port iMX8_WDOG.WDOG_B
XIN_32K: C139.1 PTP44.1(TP) QZ2.1 R47.1 U6.10(XTAL_IN)
XOUT_32K: C140.1 PTP45.1(TP) QZ2.2 R47.2 U6.11(XTAL_OUT)
NetC115#2_1: C115#2.1 PTP28#2.1(TP) U6.2(LDO2)
NetC121_2: C121.2 PTP34.1(TP) U6.1(LDO4)
NetL3_1: L3.1 PTP25#2.1(TP) U6.45(LX2_1) U6.46(LX2_2)
NetL4_1: L4.1 PTP29#2.1(TP) U6.36(LX1_1) U6.37(LX1_2)
NetL5_1: L5.1 PTP33.1(TP) U6.31(LX3_1) U6.32(LX3_2)
NetL6_1: L6.1 PTP36.1(TP) U6.19(LX4_1) U6.20(LX4_2)
NetL7_1: L7.1 PTP38#2.1(TP) U6.15(LX5)
NetL8_1: L8.1 PTP40#2.1(TP) U6.50(LX6_1) U6.51(LX6_2)
NetPTP32_1: PTP32.1(TP) R43.1 R44.1 U6.38(R_SNSP1)
NetR41_1: R41.1 R42.1 U6.44(R_SNSP2)

Not connected (* = marked no-connect by the designer): U6 6(RTC_RESET_B)*

### Layout directives
net class SEC: I2C1_SCL, I2C1_SDA

### Notes on the sheet
- (near PTP26#2) 0.8/0.9/1.0V 3A
- (near U6) 1.8V 10mA
- Sense from Processor power pin
- (near U6) 0.8V 10mA
- No need for 8M Plus
- 0.8/0.9V 3A
- (near PTP32) Buck1&3
  Dual Phase Mode
- 1.8V 300mA
- (near C120) 0.8/0.9V 3A
- (near U6) 0.8V 200mA
- # System On/Off Button
- Sense connect to GND for dual phase mode
- 3.3V/1.8V 150mA
- (near C127) # System Reset Button
- (near C125) 3.3V 3A
- (near C129) 1.8V 2A
- (near C132#2) 1.1V 2A
- 3.3V 400mA
- # System Reset Button
- PU
- (near U6) Internal LDO
- # CPU WDOG_B Reset
- (near U6) OD + PU
- (near U6) OD
- (near U6) Configure internal pull up at CPU side
- Add PU if using level translator (per DS).
  Float if unused.
- (near R47) 1M
- (near U6) Note:
- i.MX8M Plus LPDDR4 EVK Power Sequence and Operating Range
- (near U6) 1. PMIC_RST_B is used as Cold Reset as default.
- (near U6) 2. WDOG_B is used as Cold Reset, external pull up is needed for BSDL mode.
- SEQ
- PWR/Signal
- REG
- MIN
- TYP
- MAX
- Max Current(mA)
- NVCC_SNVS_1V8
  32K_INTERNAL
  VDD_SOC
  VDD_ARM
  VDDA_1V8
  VDD_1V8/NVCC_xxx
  NVCC_DRAM_1V1
  VDD_3V3/NVCC_xxx
  VSD_3V3
  NVCC_SD2
  POR_B
- LDO1
  RTC_CLK
  BUCK1/3
  BUCK2
  LDO3
  BUCK5
  BUCK6
  BUCK4
  MUXSW
  LDO5
  POR_B
- 1.71
  --
  0.805/0.9
  0.805/0.9/0.95
  1.71
  1.65
  1.045
  3
  3
  3.0/1.65
  --
- 1.8
  --
  0.85/0.95
  0.85/0.95/1.0
  1.8
  1.8
  1.1
  3.3
  3.3
  3.3/1.8
  --
- 1.95
  --
  0.9/1.0
  0.9/1.0/1.05
  1.89
  1.95
  1.155
  3.6
  3.6
  3.6/1.95
  --
- 10
  --
  6000
  3000
  300
  2000
  2000
  3000
  400
  150
  --
- 1
  2
  3
  4
  5
  6
  7
  8
  8
  9
  10
- DWG NO:
- REV:
- THIS DOCUMENT AND THE DATA DISCLOSED HEREIN OR
- HEREWITH IS THE PROPERTY OF ALTIUM LIMITED AND MAY
- BE FREELY DISTRIBUTED IN WHOLE. NO RIGHTS ARE
- RESERVED OR EXPRESS OR IMPLIED WARANTEE GIVEN.
- REVISION
- DESCRIPTION
- DATE
- APPROVED
- ENG:
- APPROVALS
- PROJECT
- DSN:
- CHK:
- REFERENCE DOCUMENTS
- PROJECT REVISION:
- TITLE
- DOCUMENT REVISION:
- DESIGN ITEM:
- BOM:
- FAB DWG:
- PCB DWG:
- ASSY DWG:
- SCALE:
- A2
- SIZE
- CAGE CODE
- FILE NAME
- DWG NO.
- SHEET
- OF
- REV

### Library data of the parts
C110#2 C114#2 C118#2 C123 C127 C128 C131 C135#2 = CMP-001-001253-9: CAP; Part Number: GRM188Z71A106KA73D; Manufacturer: Murata; Voltage: 10V; Tolerance: +/-10%; Temperature characteristics: X7R; Sort order: 306; Alternative component: Allowed; System: RLC; Package: 0603; ComponentLink1Description: 1_Datasheet; ComponentLink2Description: 2_Product page; ComponentLink3Description: 3_X-information; ComponentLink4Description: 4_X-information; Creation date: 20240404; Manufacturer Part Number: GRM188Z71A106KA73D; Component Type: Capacitor
C111#2 C116#2 C120 C125 C129 C132#2 = CMP-001-000259-10: Not Assembled - CAP; Sort order: 999; System: RLC; HasBeenBuilt: TBD; Creation date: 20190101; Package: 0603; Source: RLC_UN1Q.SchLib; ComponentLink3Description: 3_X-information; ComponentLink1Description: 1_Datasheet; ComponentLink2Description: 2_Product page; ComponentLink4Description: 4_X-information; Component Type: Capacitor
C112#2 C115#2 = CMP-001-000336-15: CAP; Part Number: KGM03CS61A105MH; Manufacturer: Kyocera; Manufacturer: Kyocera AVX; Temperature characteristics: X6S; Voltage: 10V; Tolerance: +/-20%; Sort order: 302; HasBeenBuilt: False; Alternative component: Allowed; System: RLC; Package: 0201; Operating temperature range: -55C to +105C; ClassName: SMALL; ComponentLink1Description: 1_Datasheet; ComponentLink2Description: 2_Product page; ComponentLink3Description: 3_X-information; ComponentLink4Description: 4_X-information; Creation date: 20190101; Source: RLC_UN1Q.SchLib; Manufacturer Part Number: KGM03CS61A105MH; Component Type: Capacitor
C113#2 C117#2 C122 C126 C130 C133#2 = CMP-001-000890-13: CAP; Part Number: GRM188C80J226ME15D; Manufacturer: Murata; Voltage: 6.3V; Tolerance: +/-20%; Temperature characteristics: X6S; Sort order: 306; HasBeenBuilt: TBD; Alternative component: Allowed; System: RLC; Package: 0603; ComponentLink1Description: 1_Datasheet; ComponentLink2Description: 2_Product page; ComponentLink3Description: 3_X-information; ComponentLink4Description: 4_X-information; Creation date: 26042024; Manufacturer Part Number: GRM188C80J226ME15D; Component Type: Capacitor
C119#2 = CMP-001-000883-14: CAP; Part Number: GMC04X6S106M6R3NT; Manufacturer: Cal-Chip Electronics, Inc.; Manufacturer: Cal-Chip Electronics; Voltage: 6.3V; Tolerance: +/-20%; Temperature characteristics: X6S; Sort order: 304; HasBeenBuilt: TBD; Alternative component: Allowed; System: RLC; Package: 0402; ComponentLink1Description: 1_Datasheet; ComponentLink2Description: 2_Product page; ComponentLink3Description: 3_X-information; ComponentLink4Description: 4_X-information; Creation date: 26042024; Manufacturer Part Number: GMC04X6S106M6R3NT; Component Type: Capacitor
C121 C124 C138 = CMP-001-000888-12: CAP; Part Number: GRT155C81A475ME13J; Manufacturer: Murata; Sort order: 304; HasBeenBuilt: TBD; Alternative component: Allowed; System: RLC; Voltage: 10V; Temperature characteristics: X6S; Tolerance: +/-10%; ComponentLink2Description: 2_Product page; Package: 0402; Creation date: 26042024; ComponentLink1Description: 1_Datasheet; ComponentLink3Description: 3_X-information; ComponentLink4Description: 4_X-information; Manufacturer Part Number: GRT155C81A475ME13J; Component Type: Capacitor
C134#2 C136#2 C137 = CMP-001-001247-9: CAP; Part Number: GRM155Z71A105KE01J; Manufacturer: Murata; Temperature characteristics: X7R; Voltage: 10V; Tolerance: +/-10%; Sort order: 304; Alternative component: Allowed; System: RLC; Package: 0402; ComponentLink1Description: 1_Datasheet; ComponentLink2Description: 2_Product page; ComponentLink3Description: 3_X-information; ComponentLink4Description: 4_X-information; Creation date: 20240404; Manufacturer Part Number: GRM155Z71A105KE01J; Component Type: Capacitor
C139 C140 = CMP-001-000420-11: CAP_RF_MATCHING; Part Number: GRM0335C1H120GA01; Manufacturer: Murata; Voltage: 50V; Tolerance: +/- 2%; Temperature characteristics: C0G; Remark: RF matching, use part number; Sort order: 202; HasBeenBuilt: TBD; System: RLC; Package: 0201; Operating temperature range: -55 ... +125C; ComponentLink1Description: 1_Datasheet; ComponentLink2Description: 2_Product page; ComponentLink3Description: 3_X-information; ComponentLink4Description: 4_X-information; Creation date: 20211123; ClassName: SMALL; Source: RLC_UN1Q.SchLib; Manufacturer Part Number: GRM0335C1H120GA01; Component Type: Capacitor
J2 J3#2 = CMP-001-000157-12: Part Number: TP 1x2mm; System: Test Point; Sort order: -; HasBeenBuilt: -; ClassName: SMALL; ComponentLink1Description: 1_Datasheet; ComponentLink2Description: 2_Product page; ComponentLink3Description: 3_X-information; ComponentLink4Description: 4_X-information; Creation date: 20200101; Source: Conn_UN1Q.SchLib; Design Item ID: TP_1x2mm; Component Type: Test Point
L2 = CMP-001-000738-12: FERRITE; Part Number: BLM15KD300SN1; Manufacturer: Murata; Manufacturer Part Number: BLM15KD300SN1D; Sort order: 364; HasBeenBuilt: Saluki2; System: Discrete; Package: 0402; Operating temperature range: -55 ... +125C; Dimensions WxLxH: 0.55mm; ComponentLink1Description: 1_Datasheet; ComponentLink1URL: https://www.murata.com/en-us/products/productdetail.aspx?cate=luNoiseSupprFilteChipFerriBead&partno=BLM15KD300SN1%23; ComponentLink2Description: 2_Product page; ComponentLink3Description: 3_X-information; ComponentLink4Description: 4_X-information; Creation date: 20200304; Source: Discrete_UN1Q.SchLib; ECCN: EAR99; RoHS: RoHS3; Component Type: Ferrite
L3-L8 = CMP-001-000947-11: IND, Low DCR shielded; Manufacturer: TDK; Part Number: VLS252012HBX-R47M-1; Sort order: 348; System: RLC; Package: 2520; Dimensions WxLxH: 2.5 x 2.0 x 1.2mm; ClassName: BIG; ComponentLink1Description: 1_Datasheet; ComponentLink1URL: https://product.tdk.com/en/system/files?file=dam/doc/product/inductor/inductor/smd/catalog/inductor_commercial_power_vls252012hbx-1_en.pdf; Operating temperature range: -40 ... +105 °C; Creation date: 09022024; Source: UUDET_KOMPONENTIT.SchLib; ComponentLink2Description: 2_Product page; ComponentLink3Description: 3_X-information; ComponentLink4Description: 4_X-information; Manufacturer Part Number: VLS252012HBX-R47M-1; Component Type: Inductor
PTP25#2 PTP26#2 PTP27#2 PTP28#2 PTP29#2 PTP30-PTP37 PTP38#2 PTP39#2 PTP40#2 PTP41-PTP43 = CMP-001-001296-3: Production Testpoint 0.4mm. Flying probe. Use 1mm pitch.; Part Number: PTP 0.4mm; ComponentLink4Description: 4_X-information; ComponentLink1Description: 1_Datasheet; Sort order: -; ClassName: SMALL; System: Test Point; HasBeenBuilt: -; Design Item ID: PTP_0.4mm; ComponentLink3Description: 3_X-information; Creation date: 20240909; ComponentLink2Description: 2_Product page; Component Type: Test Point
PTP44 PTP45 = CMP-001-001296-3: as PTP12 on sheet IMX8_PHY; ComponentLink4Description: 4_X-information; ComponentLink1Description: 1_Datasheet; Part Number: PTP 0.4mm; Sort order: -; ClassName: SMALL; System: Test Point; HasBeenBuilt: -; Design Item ID: PTP_0.4mm; ComponentLink3Description: 3_X-information; Creation date: 20240909; ComponentLink2Description: 2_Product page
QZ2 = CMP-001-000697-8: SMT Quartz Crystal; Part Number: CM8V-T1A-32.768KHZ-9PF-20PPM-TA-QC; HasBeenBuilt: SleeveIO_01; Sort order: 455; System: Discrete; ClassName: BIG; ComponentLink1Description: 1_Datasheet; ComponentLink1URL: https://www.microcrystal.com/fileadmin/Media/Products/32kHz/Datasheet/CM8V-T1A.pdf; ComponentLink2Description: 2_Product page; ComponentLink2URL: https://www.microcrystal.com/en/products/khz-quartz-crystals/cm8v-t1a/; ComponentLink3Description: 3_X-information; ComponentLink4Description: 4_X-information; Creation date: 20210913; Dimensions WxLxH: 1.2x2.0x0.6mm; Operating temperature range: -40 .... +85 °C; Package: 2-SMD; Source: Discrete_UN1Q.SchLib; Manufacturer Part Number: CM8V-T1A-32.768KHZ-9PF-20PPM-TA-QC; Component Type: Crystal & Oscillator
R41 R43 R47 = CMP-001-000434-10: Not Assembled - RES; Sort order: 999; HasBeenBuilt: TBD; System: RLC; Package: 0201; ClassName: SMALL; ComponentLink1Description: 1_Datasheet; ComponentLink2Description: 2_Product page; ComponentLink3Description: 3_X-information; ComponentLink4Description: 4_X-information; Creation date: 20190101; Source: RLC_UN1Q.SchLib; Component Type: Resistor
R42 R44 = CMP-001-000429-13: RES; Part Number: RC0201JR-070RL; Manufacturer: YAGEO; Tolerance: 5%; Power Rating: 1/20W; Sort order: 322; HasBeenBuilt: TBD; Alternative component: Allowed; System: RLC; Package: 0201; ClassName: SMALL; ComponentLink1Description: 1_Datasheet; ComponentLink2Description: 2_Product page; ComponentLink3Description: 3_X-information; ComponentLink4Description: 4_X-information; Creation date: 20190101; Source: RLC_UN1Q.SchLib; Component Type: Resistor
R45 R46 = CMP-001-000526-11: RES; Part Number: RC0201FR-07100KL; Manufacturer: YAGEO; Tolerance: 1%; Power Rating: 1/20W; Sort order: 322; HasBeenBuilt: TBD; Alternative component: Allowed; System: RLC; Package: 0201; ClassName: SMALL; ComponentLink1Description: 1_Datasheet; ComponentLink2Description: 2_Product page; ComponentLink3Description: 3_X-information; ComponentLink4Description: 4_X-information; Creation date: 20190101; Source: RLC_UN1Q.SchLib; Component Type: Resistor
U6 = CMP-031-000204-7: POWER MANAGEMENT 2.7-5.5V HVQFN56; Sort order: 451; System: IC; ComponentLink1Description: 1_Datasheet; ComponentLink1URL: https://www.nxp.com/products/power-management/pmics-and-sbcs/pmics/power-management-ic-pmic-for-i-mx-8m-mini-nano-plus:PCA9450; ComponentLink2Description: 2_Product page; ComponentLink3Description: 3_X-information; ComponentLink4Description: 4_X-information; Creation date: 20240207; Dimensions WxLxH: 7.0x7.0x1.0; Operating temperature range: -40 .... +105 °C; Package: QFN56; Source: UUDET_KOMPONENTIT.SchLib; ClassName: BIG; Design Item ID: PCA9450CHN; Manufacturer Part Number: PCA9450CHN; Component Type: Power Supply

## Sheet IMX8_PWR.SchDoc
size 594 x 420 mm; SheetNumber: 2; SheetTotal: 7
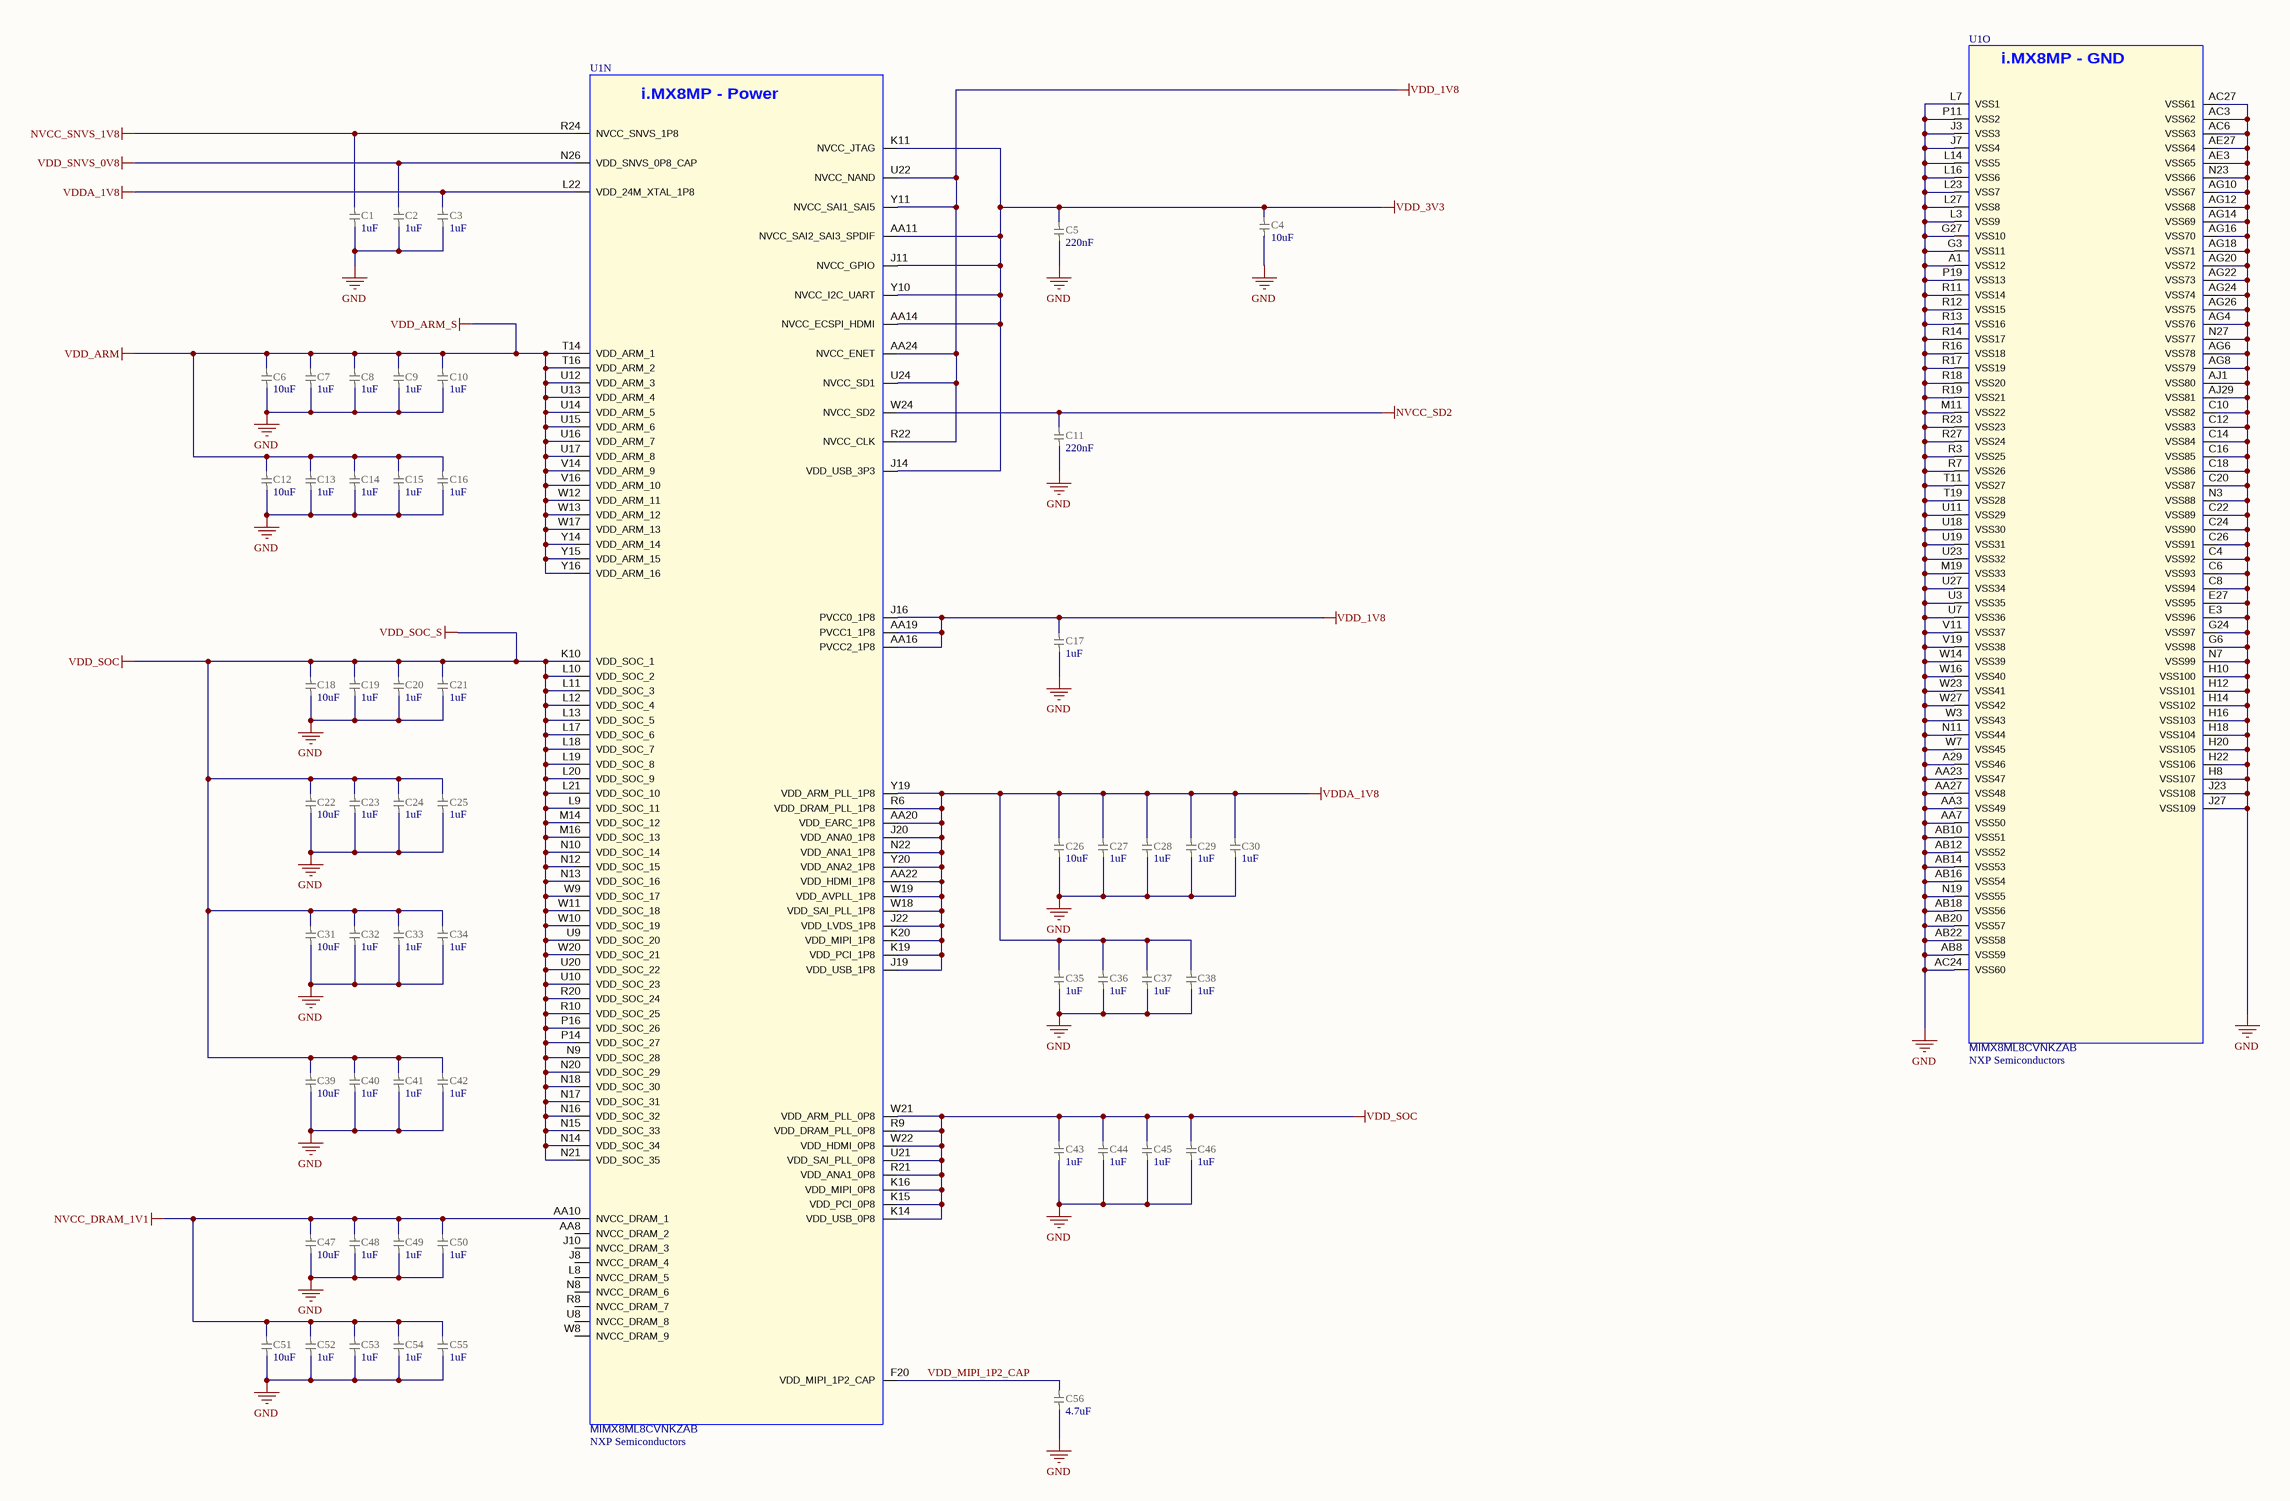
[diagram p24: IMX8_PWR.SchDoc]

### Parts
(Parts that share a designator on the sheet are numbered #1, #2 ... from top to bottom, then left to right.)
C1#2  value 1uF  [CAP_0201_UN1Q]  (hidden comment: CAP_0201_1uF_X6S)
C2#2  value 1uF  [CAP_0201_UN1Q]  (hidden comment: CAP_0201_1uF_X6S)
C3#2  value 1uF  [CAP_0201_UN1Q]  (hidden comment: CAP_0201_1uF_X6S)
C4#2  value 10uF  [CAP_0402_H09W07_UN1Q]  (hidden comment: CAP_0402_10u_X6S)
C5  value 220nF  [CAP_0201_UN1Q]  (hidden comment: CAP_0201_220n_10V_X6S)
C6  value 10uF  [CAP_0402_H09W07_UN1Q]  (hidden comment: CAP_0402_10u_X6S)
C7  value 1uF  [CAP_0201_UN1Q]  (hidden comment: CAP_0201_1uF_X6S)
C8  value 1uF  [CAP_0201_UN1Q]  (hidden comment: CAP_0201_1uF_X6S)
C9  value 1uF  [CAP_0201_UN1Q]  (hidden comment: CAP_0201_1uF_X6S)
C10  value 1uF  [CAP_0201_UN1Q]  (hidden comment: CAP_0201_1uF_X6S)
C11  value 220nF  [CAP_0201_UN1Q]  (hidden comment: CAP_0201_220n_10V_X6S)
C12  value 10uF  [CAP_0402_H09W07_UN1Q]  (hidden comment: CAP_0402_10u_X6S)
C13  value 1uF  [CAP_0201_UN1Q]  (hidden comment: CAP_0201_1uF_X6S)
C14  value 1uF  [CAP_0201_UN1Q]  (hidden comment: CAP_0201_1uF_X6S)
C15  value 1uF  [CAP_0201_UN1Q]  (hidden comment: CAP_0201_1uF_X6S)
C16  value 1uF  [CAP_0201_UN1Q]  (hidden comment: CAP_0201_1uF_X6S)
C17  value 1uF  [CAP_0201_UN1Q]  (hidden comment: CAP_0201_1uF_X6S)
C18  value 10uF  [CAP_0402_H09W07_UN1Q]  (hidden comment: CAP_0402_10u_X6S)
C19  value 1uF  [CAP_0201_UN1Q]  (hidden comment: CAP_0201_1uF_X6S)
C20  value 1uF  [CAP_0201_UN1Q]  (hidden comment: CAP_0201_1uF_X6S)
C21  value 1uF  [CAP_0201_UN1Q]  (hidden comment: CAP_0201_1uF_X6S)
C22  value 10uF  [CAP_0402_H09W07_UN1Q]  (hidden comment: CAP_0402_10u_X6S)
C23  value 1uF  [CAP_0201_UN1Q]  (hidden comment: CAP_0201_1uF_X6S)
C24  value 1uF  [CAP_0201_UN1Q]  (hidden comment: CAP_0201_1uF_X6S)
C25  value 1uF  [CAP_0201_UN1Q]  (hidden comment: CAP_0201_1uF_X6S)
C26  value 10uF  [CAP_0402_H09W07_UN1Q]  (hidden comment: CAP_0402_10u_X6S)
C27  value 1uF  [CAP_0201_UN1Q]  (hidden comment: CAP_0201_1uF_X6S)
C28  value 1uF  [CAP_0201_UN1Q]  (hidden comment: CAP_0201_1uF_X6S)
C29  value 1uF  [CAP_0201_UN1Q]  (hidden comment: CAP_0201_1uF_X6S)
C30  value 1uF  [CAP_0201_UN1Q]  (hidden comment: CAP_0201_1uF_X6S)
C31  value 10uF  [CAP_0402_H09W07_UN1Q]  (hidden comment: CAP_0402_10u_X6S)
C32  value 1uF  [CAP_0201_UN1Q]  (hidden comment: CAP_0201_1uF_X6S)
C33  value 1uF  [CAP_0201_UN1Q]  (hidden comment: CAP_0201_1uF_X6S)
C34  value 1uF  [CAP_0201_UN1Q]  (hidden comment: CAP_0201_1uF_X6S)
C35  value 1uF  [CAP_0201_UN1Q]  (hidden comment: CAP_0201_1uF_X6S)
C36  value 1uF  [CAP_0201_UN1Q]  (hidden comment: CAP_0201_1uF_X6S)
C37  value 1uF  [CAP_0201_UN1Q]  (hidden comment: CAP_0201_1uF_X6S)
C38  value 1uF  [CAP_0201_UN1Q]  (hidden comment: CAP_0201_1uF_X6S)
C39  value 10uF  [CAP_0402_H09W07_UN1Q]  (hidden comment: CAP_0402_10u_X6S)
C40  value 1uF  [CAP_0201_UN1Q]  (hidden comment: CAP_0201_1uF_X6S)
C41  value 1uF  [CAP_0201_UN1Q]  (hidden comment: CAP_0201_1uF_X6S)
C42  value 1uF  [CAP_0201_UN1Q]  (hidden comment: CAP_0201_1uF_X6S)
C43  value 1uF  [CAP_0201_UN1Q]  (hidden comment: CAP_0201_1uF_X6S)
C44  value 1uF  [CAP_0201_UN1Q]  (hidden comment: CAP_0201_1uF_X6S)
C45  value 1uF  [CAP_0201_UN1Q]  (hidden comment: CAP_0201_1uF_X6S)
C46  value 1uF  [CAP_0201_UN1Q]  (hidden comment: CAP_0201_1uF_X6S)
C47  value 10uF  [CAP_0402_H09W07_UN1Q]  (hidden comment: CAP_0402_10u_X6S)
C48  value 1uF  [CAP_0201_UN1Q]  (hidden comment: CAP_0201_1uF_X6S)
C49  value 1uF  [CAP_0201_UN1Q]  (hidden comment: CAP_0201_1uF_X6S)
C50  value 1uF  [CAP_0201_UN1Q]  (hidden comment: CAP_0201_1uF_X6S)
C51  value 10uF  [CAP_0402_H09W07_UN1Q]  (hidden comment: CAP_0402_10u_X6S)
C52  value 1uF  [CAP_0201_UN1Q]  (hidden comment: CAP_0201_1uF_X6S)
C53  value 1uF  [CAP_0201_UN1Q]  (hidden comment: CAP_0201_1uF_X6S)
C54  value 1uF  [CAP_0201_UN1Q]  (hidden comment: CAP_0201_1uF_X6S)
C55  value 1uF  [CAP_0201_UN1Q]  (hidden comment: CAP_0201_1uF_X6S)
C56  value 4.7uF  [CAP_0402_H09W07_UN1Q]  (hidden comment: CAP_0402_4u7_10V_X6S)
U1  Manufacturer: NXP Semiconductors  [BGA548C50P29X29_1500X1500X148]  (hidden comment: MIMX8ML8CVNKZAB)  (parts N,O of 15)

### Nets
GND: C1#2.1 C2#2.1 C3#2.1 C4#2.1 C5.1 C6.1 C7.1 C8.1 C9.1 C10.1 C11.1 C12.1 C13.1 C14.1 C15.1 C16.1 C17.1 C18.1 C19.1 C20.1 C21.1 C22.1 C23.1 C24.1 C25.1 C26.1 C27.1 C28.1 C29.1 C30.1 C31.1 C32.1 C33.1 C34.1 C35.1 C36.1 C37.1 C38.1 C39.1 C40.1 C41.1 C42.1 C43.1 C44.1 C45.1 C46.1 C47.1 C48.1 C49.1 C50.1 C51.1 C52.1 C53.1 C54.1 C55.1 C56.1 U1.A1(VSS12) U1.A29(VSS46) U1.AA3(VSS49) U1.AA7(VSS50) U1.AA23(VSS47) U1.AA27(VSS48) U1.AB8(VSS59) U1.AB10(VSS51) U1.AB12(VSS52) U1.AB14(VSS53) U1.AB16(VSS54) U1.AB18(VSS56) U1.AB20(VSS57) U1.AB22(VSS58) U1.AC3(VSS62) U1.AC6(VSS63) U1.AC24(VSS60) U1.AC27(VSS61) U1.AE3(VSS65) U1.AE27(VSS64) U1.AG4(VSS76) U1.AG6(VSS78) U1.AG8(VSS79) U1.AG10(VSS67) U1.AG12(VSS68) U1.AG14(VSS69) U1.AG16(VSS70) U1.AG18(VSS71) U1.AG20(VSS72) U1.AG22(VSS73) U1.AG24(VSS74) U1.AG26(VSS75) U1.AJ1(VSS80) U1.AJ29(VSS81) U1.C4(VSS92) U1.C6(VSS93) U1.C8(VSS94) U1.C10(VSS82) U1.C12(VSS83) U1.C14(VSS84) U1.C16(VSS85) U1.C18(VSS86) U1.C20(VSS87) U1.C22(VSS89) U1.C24(VSS90) U1.C26(VSS91) U1.E3(VSS96) U1.E27(VSS95) U1.G3(VSS11) U1.G6(VSS98) U1.G24(VSS97) U1.G27(VSS10) U1.H8(VSS107) U1.H10(VSS100) U1.H12(VSS101) U1.H14(VSS102) U1.H16(VSS103) U1.H18(VSS104) U1.H20(VSS105) U1.H22(VSS106) U1.J3(VSS3) U1.J7(VSS4) U1.J23(VSS108) U1.J27(VSS109) U1.L3(VSS9) U1.L7(VSS1) U1.L14(VSS5) U1.L16(VSS6) U1.L23(VSS7) U1.L27(VSS8) U1.M11(VSS22) U1.M19(VSS33) U1.N3(VSS88) U1.N7(VSS99) U1.N11(VSS44) U1.N19(VSS55) U1.N23(VSS66) U1.N27(VSS77) U1.P11(VSS2) U1.P19(VSS13) U1.R3(VSS25) U1.R7(VSS26) U1.R11(VSS14) U1.R12(VSS15) U1.R13(VSS16) U1.R14(VSS17) U1.R16(VSS18) U1.R17(VSS19) U1.R18(VSS20) U1.R19(VSS21) U1.R23(VSS23) U1.R27(VSS24) U1.T11(VSS27) U1.T19(VSS28) U1.U3(VSS35) U1.U7(VSS36) U1.U11(VSS29) U1.U18(VSS30) U1.U19(VSS31) U1.U23(VSS32) U1.U27(VSS34) U1.V11(VSS37) U1.V19(VSS38) U1.W3(VSS43) U1.W7(VSS45) U1.W14(VSS39) U1.W16(VSS40) U1.W23(VSS41) U1.W27(VSS42)
NVCC_DRAM_1V1: C47.2 C48.2 C49.2 C50.2 C51.2 C52.2 C53.2 C54.2 C55.2 U1.AA10(NVCC_DRAM_1)
NVCC_SD2: C11.2 U1.W24(NVCC_SD2)
NVCC_SNVS_1V8: C1#2.2 U1.R24(NVCC_SNVS_1P8)
VDD_1V8: C17.2 U1.AA16(PVCC2_1P8) U1.AA19(PVCC1_1P8) U1.AA24(NVCC_ENET) U1.J16(PVCC0_1P8) U1.R22(NVCC_CLK) U1.U22(NVCC_NAND) U1.U24(NVCC_SD1) U1.Y11(NVCC_SAI1_SAI5)
VDD_3V3: C4#2.2 C5.2 U1.AA11(NVCC_SAI2_SAI3_SPDIF) U1.AA14(NVCC_ECSPI_HDMI) U1.J11(NVCC_GPIO) U1.J14(VDD_USB_3P3) U1.K11(NVCC_JTAG) U1.Y10(NVCC_I2C_UART)
VDD_ARM: C6.2 C7.2 C8.2 C9.2 C10.2 C12.2 C13.2 C14.2 C15.2 C16.2 U1.T14(VDD_ARM_1) U1.T16(VDD_ARM_2) U1.U12(VDD_ARM_3) U1.U13(VDD_ARM_4) U1.U14(VDD_ARM_5) U1.U15(VDD_ARM_6) U1.U16(VDD_ARM_7) U1.U17(VDD_ARM_8) U1.V14(VDD_ARM_9) U1.V16(VDD_ARM_10) U1.W12(VDD_ARM_11) U1.W13(VDD_ARM_12) U1.W17(VDD_ARM_13) U1.Y14(VDD_ARM_14) U1.Y15(VDD_ARM_15) U1.Y16(VDD_ARM_16)  [also labelled VDD_ARM_S]
VDD_SNVS_0V8: C2#2.2 U1.N26(VDD_SNVS_0P8_CAP)
VDD_SOC: C18.2 C19.2 C20.2 C21.2 C22.2 C23.2 C24.2 C25.2 C31.2 C32.2 C33.2 C34.2 C39.2 C40.2 C41.2 C42.2 C43.2 C44.2 C45.2 C46.2 U1.K10(VDD_SOC_1) U1.K14(VDD_USB_0P8) U1.K15(VDD_PCI_0P8) U1.K16(VDD_MIPI_0P8) U1.L9(VDD_SOC_11) U1.L10(VDD_SOC_2) U1.L11(VDD_SOC_3) U1.L12(VDD_SOC_4) U1.L13(VDD_SOC_5) U1.L17(VDD_SOC_6) U1.L18(VDD_SOC_7) U1.L19(VDD_SOC_8) U1.L20(VDD_SOC_9) U1.L21(VDD_SOC_10) U1.M14(VDD_SOC_12) U1.M16(VDD_SOC_13) U1.N9(VDD_SOC_28) U1.N10(VDD_SOC_14) U1.N12(VDD_SOC_15) U1.N13(VDD_SOC_16) U1.N14(VDD_SOC_34) U1.N15(VDD_SOC_33) U1.N16(VDD_SOC_32) U1.N17(VDD_SOC_31) U1.N18(VDD_SOC_30) U1.N20(VDD_SOC_29) U1.N21(VDD_SOC_35) U1.P14(VDD_SOC_27) U1.P16(VDD_SOC_26) U1.R9(VDD_DRAM_PLL_0P8) U1.R10(VDD_SOC_25) U1.R20(VDD_SOC_24) U1.R21(VDD_ANA1_0P8) U1.U9(VDD_SOC_20) U1.U10(VDD_SOC_23) U1.U20(VDD_SOC_22) U1.U21(VDD_SAI_PLL_0P8) U1.W9(VDD_SOC_17) U1.W10(VDD_SOC_19) U1.W11(VDD_SOC_18) U1.W20(VDD_SOC_21) U1.W21(VDD_ARM_PLL_0P8) U1.W22(VDD_HDMI_0P8)  [also labelled VDD_SOC_S]
VDDA_1V8: C3#2.2 C26.2 C27.2 C28.2 C29.2 C30.2 C35.2 C36.2 C37.2 C38.2 U1.AA20(VDD_EARC_1P8) U1.AA22(VDD_HDMI_1P8) U1.J19(VDD_USB_1P8) U1.J20(VDD_ANA0_1P8) U1.J22(VDD_LVDS_1P8) U1.K19(VDD_PCI_1P8) U1.K20(VDD_MIPI_1P8) U1.L22(VDD_24M_XTAL_1P8) U1.N22(VDD_ANA1_1P8) U1.R6(VDD_DRAM_PLL_1P8) U1.W18(VDD_SAI_PLL_1P8) U1.W19(VDD_AVPLL_1P8) U1.Y19(VDD_ARM_PLL_1P8) U1.Y20(VDD_ANA2_1P8)
VDD_MIPI_1P2_CAP: C56.2 U1.F20(VDD_MIPI_1P2_CAP)

Not connected (* = marked no-connect by the designer): U1 AA8(NVCC_DRAM_2) J8(NVCC_DRAM_4) J10(NVCC_DRAM_3) L8(NVCC_DRAM_5) N8(NVCC_DRAM_6) R8(NVCC_DRAM_7) U8(NVCC_DRAM_8) W8(NVCC_DRAM_9)

### Notes on the sheet
- DWG NO:
- REV:
- THIS DOCUMENT AND THE DATA DISCLOSED HEREIN OR
- HEREWITH IS THE PROPERTY OF ALTIUM LIMITED AND MAY
- BE FREELY DISTRIBUTED IN WHOLE. NO RIGHTS ARE
- RESERVED OR EXPRESS OR IMPLIED WARANTEE GIVEN.
- REVISION
- DESCRIPTION
- DATE
- APPROVED
- ENG:
- APPROVALS
- PROJECT
- DSN:
- CHK:
- REFERENCE DOCUMENTS
- PROJECT REVISION:
- TITLE
- DOCUMENT REVISION:
- DESIGN ITEM:
- BOM:
- FAB DWG:
- PCB DWG:
- ASSY DWG:
- SCALE:
- A2
- SIZE
- CAGE CODE
- FILE NAME
- DWG NO.
- SHEET
- OF
- REV
- (in symbol CMP-001-000983-8, part N) i.MX8MP - Power
- (in symbol CMP-001-000983-8, part O) i.MX8MP - GND

### Library data of the parts
C1#2 C2#2 C3#2 C7-C10 C13-C17 C19-C21 C23-C25 C27-C30 C32-C38 C40-C46 C48-C50 C52-C55 = CMP-001-000336-15: as C112#2 on sheet IMX8_PMIC; Package: 0201; Operating temperature range: -55C to +105C; ClassName: SMALL; ComponentLink1Description: 1_Datasheet; ComponentLink2Description: 2_Product page; ComponentLink3Description: 3_X-information; ComponentLink4Description: 4_X-information; Creation date: 20190101; Source: RLC_UN1Q.SchLib; Manufacturer Part Number: KGM03CS61A105MH; Component Type: Capacitor
C4#2 C6 C12 C18 C22 C26 C31 C39 C47 C51 = CMP-001-000883-14: as C119#2 on sheet IMX8_PMIC; Package: 0402; ComponentLink1Description: 1_Datasheet; ComponentLink2Description: 2_Product page; ComponentLink3Description: 3_X-information; ComponentLink4Description: 4_X-information; Creation date: 26042024; Manufacturer Part Number: GMC04X6S106M6R3NT; Component Type: Capacitor
C5 C11 = CMP-001-000889-11: as C83-C86 on sheet IMX8_PHY; Package: 0201; Dimensions WxLxH: 0.35; ComponentLink1Description: 1_Datasheet; ComponentLink2Description: 2_Product page; ComponentLink3Description: 3_X-information; ComponentLink4Description: 4_X-information; Creation date: 26042024; ClassName: SMALL; Manufacturer Part Number: GRM033C81A224KE01D; Component Type: Capacitor
C56 = CMP-001-000888-12: as C121 on sheet IMX8_PMIC; ComponentLink2Description: 2_Product page; Package: 0402; Creation date: 26042024; ComponentLink1Description: 1_Datasheet; ComponentLink3Description: 3_X-information; ComponentLink4Description: 4_X-information; Manufacturer Part Number: GRT155C81A475ME13J; Component Type: Capacitor
U1 = CMP-001-000983-8: as U1 on sheet IMX8_PHY; ComponentLink1Description: 1_Datasheet; ComponentLink1URL: https://www.nxp.com/part/MIMX8ML8CVNKZAB#/; ComponentLink2Description: 2_Product page; ComponentLink3Description: 3_X-information; ComponentLink4Description: 4_X-information; Creation date: 20240524; Dimensions WxLxH: 15 x 15 x 1.33mm; Manufacturer: NXP SEMICONDUCTORS; Operating temperature range: -40... +105 °C; Package: FCBGA548; Part Number: MIMX8ML8CVNKZAB; ClassName: BIG; Source: UUDET_KOMPONENTIT.SchLib; Design Item ID: MIMX8ML8CVNKZAB; Manufacturer Part Number: MIMX8ML8CVNKZAB; Component Type: Processor